# EAGLE schematic memory (EAGLE 6.6.0), part 1 of 2

## Sheet 1 of 15
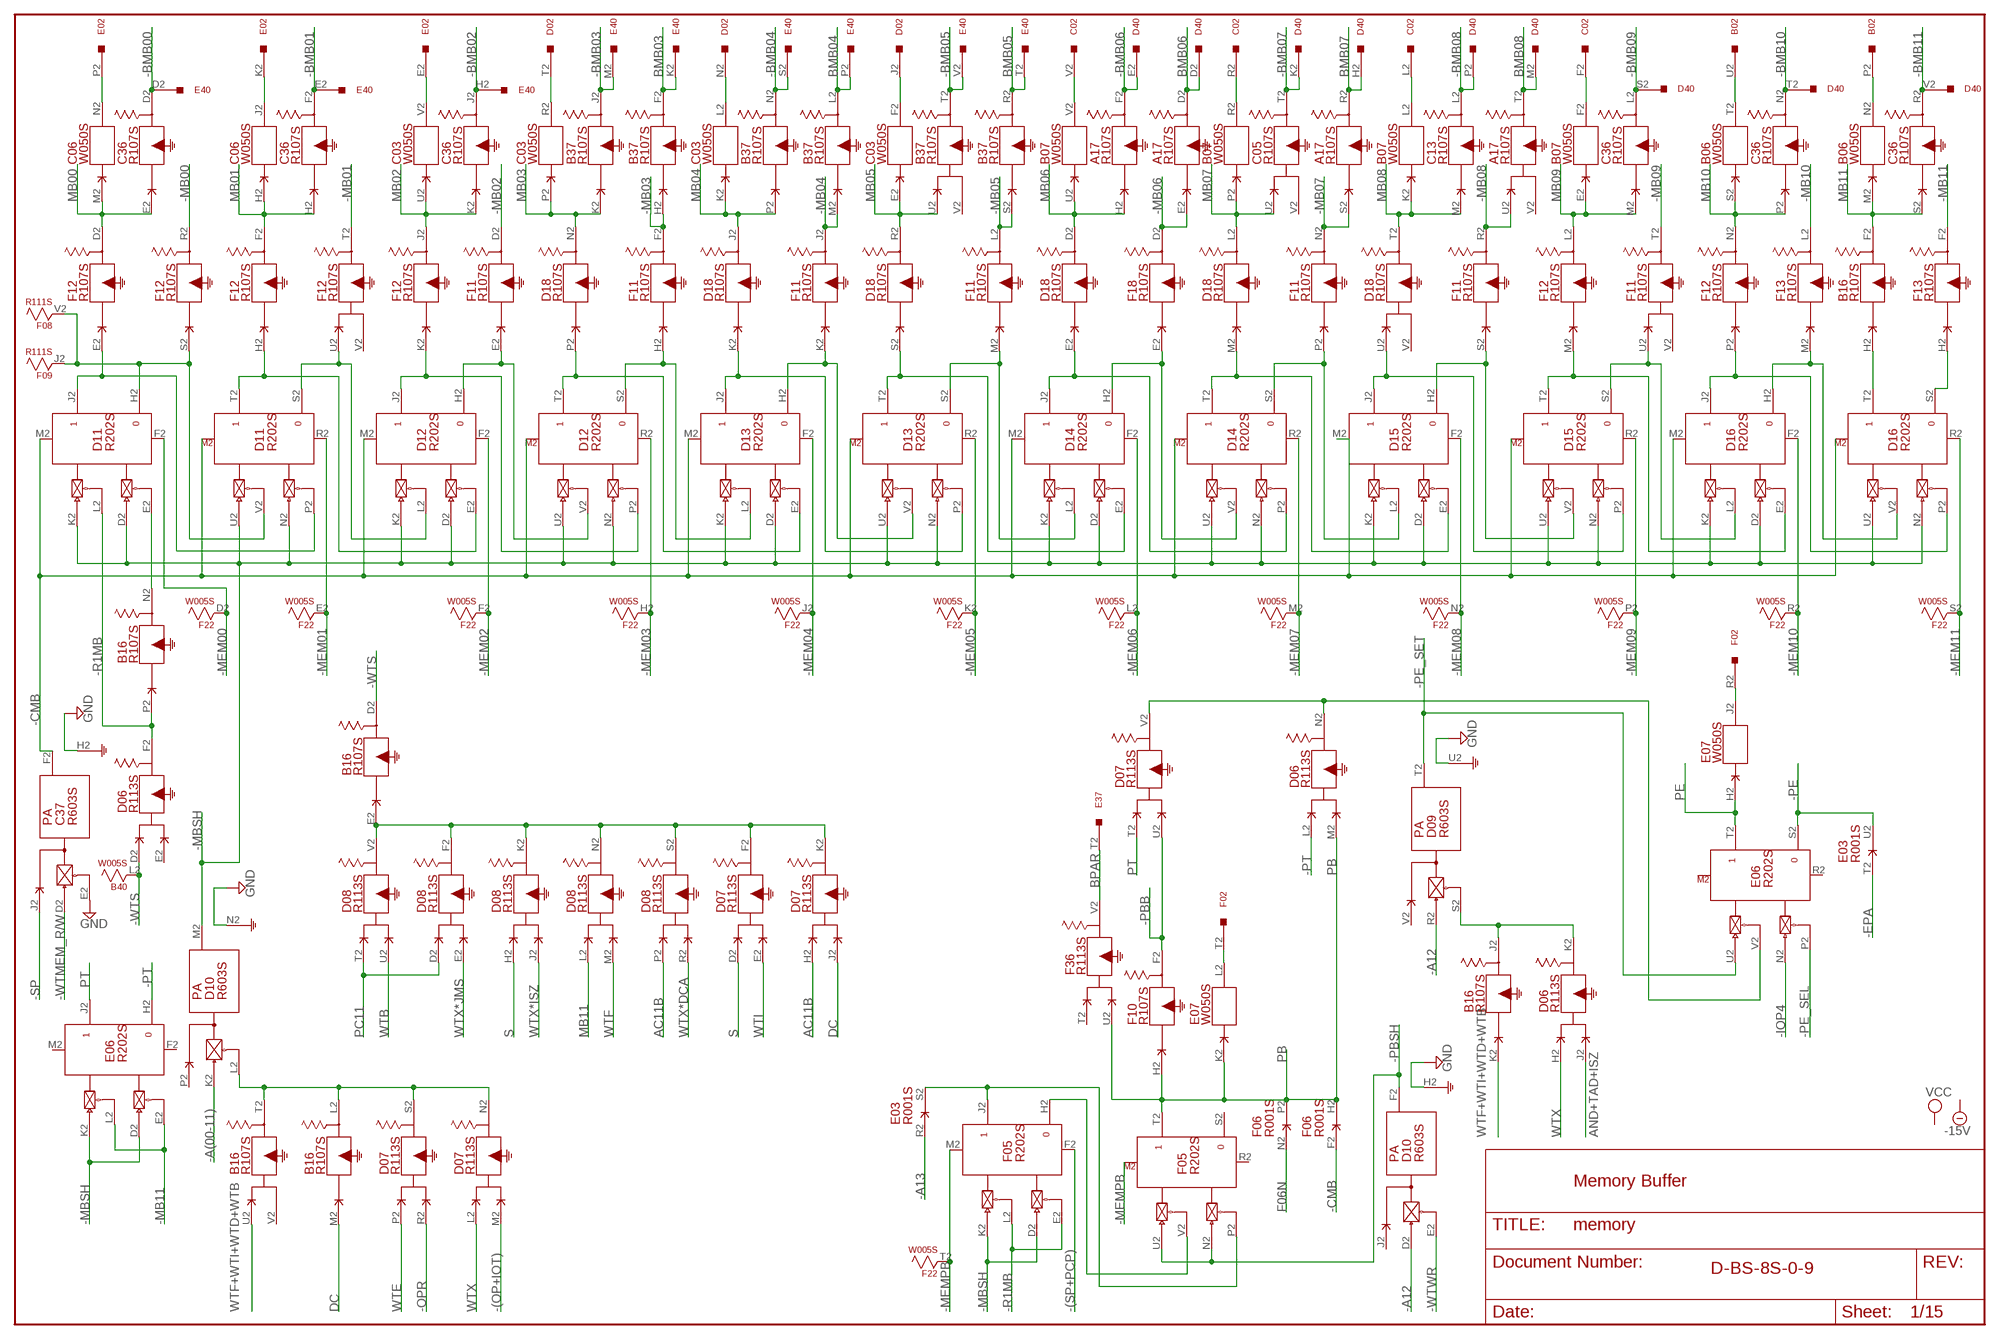
[diagram p0: schematic, sheet 1]

### Parts
A17  R107S  [H807S]
B02  W023S  [H807S]
B06  W050S  [H807S]
B07  W050S  [H807S]
B16  R107S  [H807S]
B37  R107S  [H807S]
B40  W005S  [H807S]
C02  W023S  [H807S]
C03  W050S  [H807S]
C05  R107S  [H807S]
C06  W050S  [H807S]
C13  R107S  [H807S]
C36  R107S  [H807S]
C37  R603S  [H807S]
D02  W023S  [H807S]
D06  R113S  [H807S]
D07  R113S  [H807S]
D08  R113S  [H807S]
D09  R603S  [H807S]
D10  R603S  [H807S]
D11  R202S  [H807S]
D12  R202S  [H807S]
D13  R202S  [H807S]
D14  R202S  [H807S]
D15  R202S  [H807S]
D16  R202S  [H807S]
D18  R107S  [H807S]
D40  W028S  [H807S]
E02  W023S  [H807S]
E03  R001S  [H807S]
E06  R202S  [H807S]
E07  W050S  [H807S]
E37  W028S  [H807S]
E40  W028S  [H807S]
F02  W023S  [H807S]
F05  R202S  [H807S]
F06  R001S  [H807S]
F08  R111S  [H807S]
F09  R111S  [H807S]
F10  R107S  [H807S]
F11  R107S  [H807S]
F12  R107S  [H807S]
F13  R107S  [H807S]
F18  R107S  [H807S]
F22  W005S  [H807S]
F36  R113S  [H807S]

### Nets
-(OP+IOT): D07.M2(N:I$2) ; also sheet 6,9
-(SP+PCP): F05.F2(J:RESET) ; also sheet 3,7,8,10,12,14,15
-A12: D09.R2(T:PU0) D10.D2(F:PU0) ; also sheet 3,4,6,8,10,12,15
-A13: E03.R2(S:D) ; also sheet 4,5,6,7,10,15
-A(00-11): D10.K2(M:PU0) ; also sheet 3,4,5,7,9,11,12
-BMB00: C36.D2(D:O$1) E40.D2
-BMB01: C36.F2(F:O$1) E40.E2
-BMB02: C36.J2(J:O$1) E40.H2
-BMB03: B37.J2(J:O$1) E40.M2
-BMB04: B37.N2(N:O$1) E40.S2
-BMB05: B37.T2(T:O$1) E40.V2
-BMB06: A17.F2(F:O$1) D40.E2
-BMB07: C05.T2(T:O$1) D40.K2
-BMB08: C13.L2(L:O$1) D40.P2
-BMB09: C36.L2(L:O$1) D40.S2
-BMB10: C36.N2(N:O$1) D40.T2
-BMB11: C36.R2(R:O$1) D40.V2
-CMB: C37.F2(F:O) D11.M2(J:SET) D12.M2(J:SET) D13.M2(J:SET) D14.M2(J:SET) D15.M2(J:SET) D16.M2(J:SET) F06.F2(H:D)
-EPA: E03.T2(U:D) ; also sheet 8
-IOP4: E06.N2(T:PU0) ; also sheet 10
-MB00: F12.R2(R:O$1) ; also sheet 2
-MB01: F12.T2(T:O$1) ; also sheet 2
-MB02: F11.D2(D:O$1) ; also sheet 2
-MB03: B37.H2(F:I$1) F11.F2(F:O$1) ; also sheet 2,10
-MB04: B37.M2(L:I$1) F11.J2(J:O$1) ; also sheet 2,5,10
-MB05: B37.S2(R:I$1) F11.L2(L:O$1) ; also sheet 2,6,10
-MB06: A17.E2(D:I$1) F18.D2(D:O$1) ; also sheet 2,6,7,10
-MB07: A17.S2(R:I$1) F11.N2(N:O$1) ; also sheet 2,6,10
-MB08: A17.U2(T:I$1) F11.R2(R:O$1) ; also sheet 2,3,10
-MB09: F11.T2(T:O$1) ; also sheet 2,10
-MB10: F13.L2(L:O$1) ; also sheet 2,9,10
-MB11: E06.E2(J:EN0) E06.L2(J:EN1) F13.F2(F:O$1) ; also sheet 2,9,10
-MBSH: D10.M2(M:O) D11.D2(J:PU0) D11.K2(J:PU1) D11.N2(T:PU0) D11.U2(T:PU1) D12.D2(J:PU0) D12.K2(J:PU1) D12.N2(T:PU0) D12.U2(T:PU1) D13.D2(J:PU0) D13.K2(J:PU1) D13.N2(T:PU0) D13.U2(T:PU1) D14.D2(J:PU0) D14.K2(J:PU1) D14.N2(T:PU0) D14.U2(T:PU1) D15.D2(J:PU0) D15.K2(J:PU1) D15.N2(T:PU0) D15.U2(T:PU1) D16.D2(J:PU0) D16.K2(J:PU1) D16.N2(T:PU0) D16.U2(T:PU1) E06.D2(J:PU0) E06.K2(J:PU1) F05.D2(J:PU0) F05.K2(J:PU1)
-MEM00: D11.F2(J:RESET) F22.D2 ; also sheet 2,15
-MEM01: D11.R2(T:RESET) F22.E2 ; also sheet 2,15
-MEM02: D12.F2(J:RESET) F22.F2 ; also sheet 2,15
-MEM03: D12.R2(T:RESET) F22.H2 ; also sheet 2,15
-MEM04: D13.F2(J:RESET) F22.J2 ; also sheet 2,15
-MEM05: D13.R2(T:RESET) F22.K2 ; also sheet 2,15
-MEM06: D14.F2(J:RESET) F22.L2 ; also sheet 2,15
-MEM07: D14.R2(T:RESET) F22.M2 ; also sheet 2,15
-MEM08: D15.F2(J:RESET) F22.N2 ; also sheet 2,15
-MEM09: D15.R2(T:RESET) F22.P2 ; also sheet 2,15
-MEM10: D16.F2(J:RESET) F22.R2 ; also sheet 2,15
-MEM11: D16.R2(T:RESET) F22.S2 ; also sheet 2,15
-MEMPB: F05.M2(J:SET) F22.T2 ; also sheet 2
-OPR: D07.R2(S:I$2) ; also sheet 9
-PBB: D07.U2(V:I$2) F10.F2(F:O$1) ; also sheet 2
-PBSH: D10.F2(F:O) F05.N2(T:PU0) F05.U2(T:PU1)
-PE: E03.U2(U:E) E06.S2 ; also sheet 10
-PE_SEL: E06.P2(T:EN0) ; also sheet 10
-PE_SET: D09.T2(T:O) E06.U2(T:PU1)
-PT: D06.L2(N:I$1) E06.H2
-R1MB: B16.P2(N:I$1) D06.F2(F:O$1) D11.L2(J:EN1) F05.E2(J:EN0) F05.L2(J:EN1)
-SP: C37.J2(F:I$1) ; also sheet 6,8
-WTMEM_R/W: C37.D2(F:PU0) ; also sheet 6,13
-WTS: B16.D2(D:O$1) B40.L2 D06.D2(F:I$1) ; also sheet 4,6
-WTWR: D10.E2(F:EN0) ; also sheet 6
AC11B: D07.H2(K:I$1) D08.P2(S:I$1) ; also sheet 7,12
AND+TAD+ISZ: D06.J2(K:I$2) ; also sheet 6,9
BMB03: B37.F2(F:O$1) E40.K2
BMB04: B37.L2(L:O$1) E40.P2
BMB05: B37.R2(R:O$1) E40.T2
BMB06: A17.D2(D:O$1) D40.D2
BMB07: A17.R2(R:O$1) D40.H2
BMB08: A17.T2(T:O$1) D40.M2
BPAR: E37.T2 F36.V2(V:O$1)
DC: B16.M2(L:I$1) D07.J2(K:I$2) ; also sheet 8,12
F06N: F06.N2(P:D)
GND [Supply]: C37.E2(F:EN0) C37.H2(F:G) D09.U2(T:G) D10.H2(F:G) D10.N2(M:G) ; also sheet 2,3,4,5,6,7,8,9,10,11,12,14,15
MB00: C06.M2(N:I$1) C36.E2(D:I$1) F12.D2(D:O$1)
MB01: C06.H2(J:I$1) C36.H2(F:I$1) F12.F2(F:O$1)
MB02: C03.U2(V:I$1) C36.K2(J:I$1) F12.J2(J:O$1)
MB03: B37.K2(J:I$1) C03.P2(R:I$1) D18.N2(N:O$1)
MB04: B37.P2(N:I$1) C03.K2(L:I$1) D18.J2(J:O$1) ; also sheet 12
MB05: B37.U2(T:I$1) C03.E2(F:I$1) D18.R2(R:O$1) ; also sheet 3,9,10
MB06: A17.H2(F:I$1) B07.U2(V:I$1) D18.D2(D:O$1) ; also sheet 3,7,9
MB07: B07.P2(R:I$1) C05.U2(T:I$1) D18.L2(L:O$1) ; also sheet 3,9
MB08: B07.K2(L:I$1) C13.M2(L:I$1) D18.T2(T:O$1) ; also sheet 3,6,9
MB09: B07.E2(F:I$1) C36.M2(L:I$1) F12.L2(L:O$1) ; also sheet 3,9
MB10: B06.S2(T:I$1) C36.P2(N:I$1) F12.N2(N:O$1) ; also sheet 8,9
MB11: B06.M2(N:I$1) B16.F2(F:O$1) C36.S2(R:I$1) D08.L2(N:I$1) ; also sheet 5,6,7,9,12
N$1: D11.J2 D11.P2(T:EN0) F12.E2(D:I$1)
N$2: C06.N2(N:O$1) E02.P2
N$3: D11.H2 D11.V2(T:EN1) F08.V2 F09.J2 F12.S2(R:I$1)
N$4: D11.T2 D12.E2(J:EN0) F12.H2(F:I$1)
N$5: B16.E2(D:I$1) D07.F2(F:O$1) D07.K2(K:O$1) D08.F2(F:O$1) D08.K2(K:O$1) D08.N2(N:O$1) D08.S2(S:O$1) D08.V2(V:O$1)
N$6: D12.J2 D12.P2(T:EN0) F12.K2(J:I$1)
N$7: D12.T2 D13.E2(J:EN0) D18.P2(N:I$1)
N$8: D13.J2 D13.P2(T:EN0) D18.K2(J:I$1)
N$9: D13.T2 D14.E2(J:EN0) D18.S2(R:I$1)
N$10: D14.J2 D14.P2(T:EN0) D18.E2(D:I$1)
N$11: D14.T2 D15.E2(J:EN0) D18.M2(L:I$1)
N$12: D15.J2 D15.P2(T:EN0) D18.U2(T:I$1)
N$13: D15.H2 D15.V2(T:EN1) F11.S2(R:I$1)
N$14: D14.S2 D15.L2(J:EN1) F11.P2(N:I$1)
N$15: D14.H2 D14.V2(T:EN1) F18.E2(D:I$1)
N$16: D13.S2 D14.L2(J:EN1) F11.M2(L:I$1)
N$17: D15.T2 D16.E2(J:EN0) F12.M2(L:I$1)
N$18: D15.S2 D16.L2(J:EN1) F11.U2(T:I$1)
N$19: D16.J2 D16.P2(T:EN0) F12.P2(N:I$1)
N$20: D13.H2 D13.V2(T:EN1) F11.K2(J:I$1)
N$21: D12.S2 D13.L2(J:EN1) F11.H2(F:I$1)
N$22: D12.H2 D12.V2(T:EN1) F11.E2(D:I$1)
N$23: D11.S2 D12.L2(J:EN1) F12.U2(T:I$1)
N$24: D16.H2 D16.V2(T:EN1) F13.M2(L:I$1)
N$25: B16.H2(F:I$1) D16.T2
N$26: D16.S2 F13.H2(F:I$1)
N$27: C06.J2(J:O$1) E02.K2
N$28: C03.V2(V:O$1) E02.E2
N$29: C03.R2(R:O$1) D02.T2
N$30: C03.L2(L:O$1) D02.N2
N$31: C03.F2(F:O$1) D02.J2
N$32: B07.V2(V:O$1) C02.V2
N$33: B07.R2(R:O$1) C02.R2
N$34: B07.L2(L:O$1) C02.L2
N$35: B07.F2(F:O$1) C02.F2
N$36: B02.U2 B06.T2(T:O$1)
N$37: B02.P2 B06.N2(N:O$1)
N$38: B16.L2(L:O$1) B16.T2(T:O$1) D07.N2(N:O$1) D07.S2(S:O$1) D10.L2(M:EN0)
N$39: B16.N2(N:O$1) D11.E2(J:EN0)
N$40: B16.J2(J:O$1) D06.K2(K:O$1) D09.S2(T:EN0)
N$41: E07.J2(J:O$1) F02.R2
N$42: D06.N2(N:O$1) D07.V2(V:O$1) E06.V2(T:EN1)
N$44: E07.L2(L:O$1) F02.T2
N$46: F05.H2 F05.V2(T:EN1)
N$47: E03.S2(S:E) F05.J2 F05.P2(T:EN0)
PB: D06.M2(N:I$2) E07.K2(L:I$1) F05.T2 F06.H2(H:E) F06.P2(P:E) F10.H2(F:I$1) F36.U2(V:I$2)
PC11: D08.D2(F:I$1) D08.T2(V:I$1) ; also sheet 5,7,11
PE: E06.T2 E07.H2(J:I$1) ; also sheet 10
PT: D07.T2(V:I$1) E06.J2
S: D07.D2(F:I$1) D08.H2(K:I$1) ; also sheet 5,7,11,12
WTB: D08.U2(V:I$2) ; also sheet 6
WTE: D07.P2(S:I$1) ; also sheet 3,6,8
WTF: D08.M2(N:I$2) ; also sheet 3,5,6,8,10,12
WTF+WTI+WTD+WTB: B16.K2(J:I$1) B16.U2(T:I$1) ; also sheet 6
WTI: D07.E2(F:I$2) ; also sheet 6
WTX: D06.H2(K:I$1) D07.L2(N:I$1) ; also sheet 3,6,7,10,12,15
WTX*DCA: D08.R2(S:I$2) ; also sheet 6
WTX*ISZ: D08.J2(K:I$2) ; also sheet 6
WTX*JMS: D08.E2(F:I$2) ; also sheet 6
Unconnected: A17.V2(T:I$2) B02.A2 B02.B2 B02.C2 B02.S2 B16.V2(T:I$2) B37.V2(T:I$2) B40.R2 C02.A2 C02.B2 C02.C2 C02.D2 C02.J2 C02.N2 C02.T2 C05.V2(T:I$2) C36.T2(T:O$1) C36.U2(T:I$1) C36.V2(T:I$2) D02.A2 D02.B2 D02.C2 D02.D2 D02.H2 D02.M2 D02.S2 D02.V2 D06.E2(F:I$2) D09.V2(T:I$1) D10.J2(F:I$1) D10.P2(M:I$1) D18.V2(T:I$2) E02.A2 E02.B2 E02.C2 E02.J2 E02.N2 E06.F2(J:RESET) E06.M2(J:SET) E06.R2(T:RESET) E07.P2(R:I$1) E07.R2(R:O$1) E07.S2(T:I$1) E07.T2(T:O$1) F02.A2 F02.B2 F02.C2 F02.N2 F02.P2 F02.S2 F02.U2 F05.R2(T:RESET) F05.S2 F11.V2(T:I$2) F12.V2(T:I$2) F22.V2 F36.T2(V:I$1)

### Notes on the sheet
- Memory Buffer
- D-BS-8S-0-9

## Sheet 2 of 15
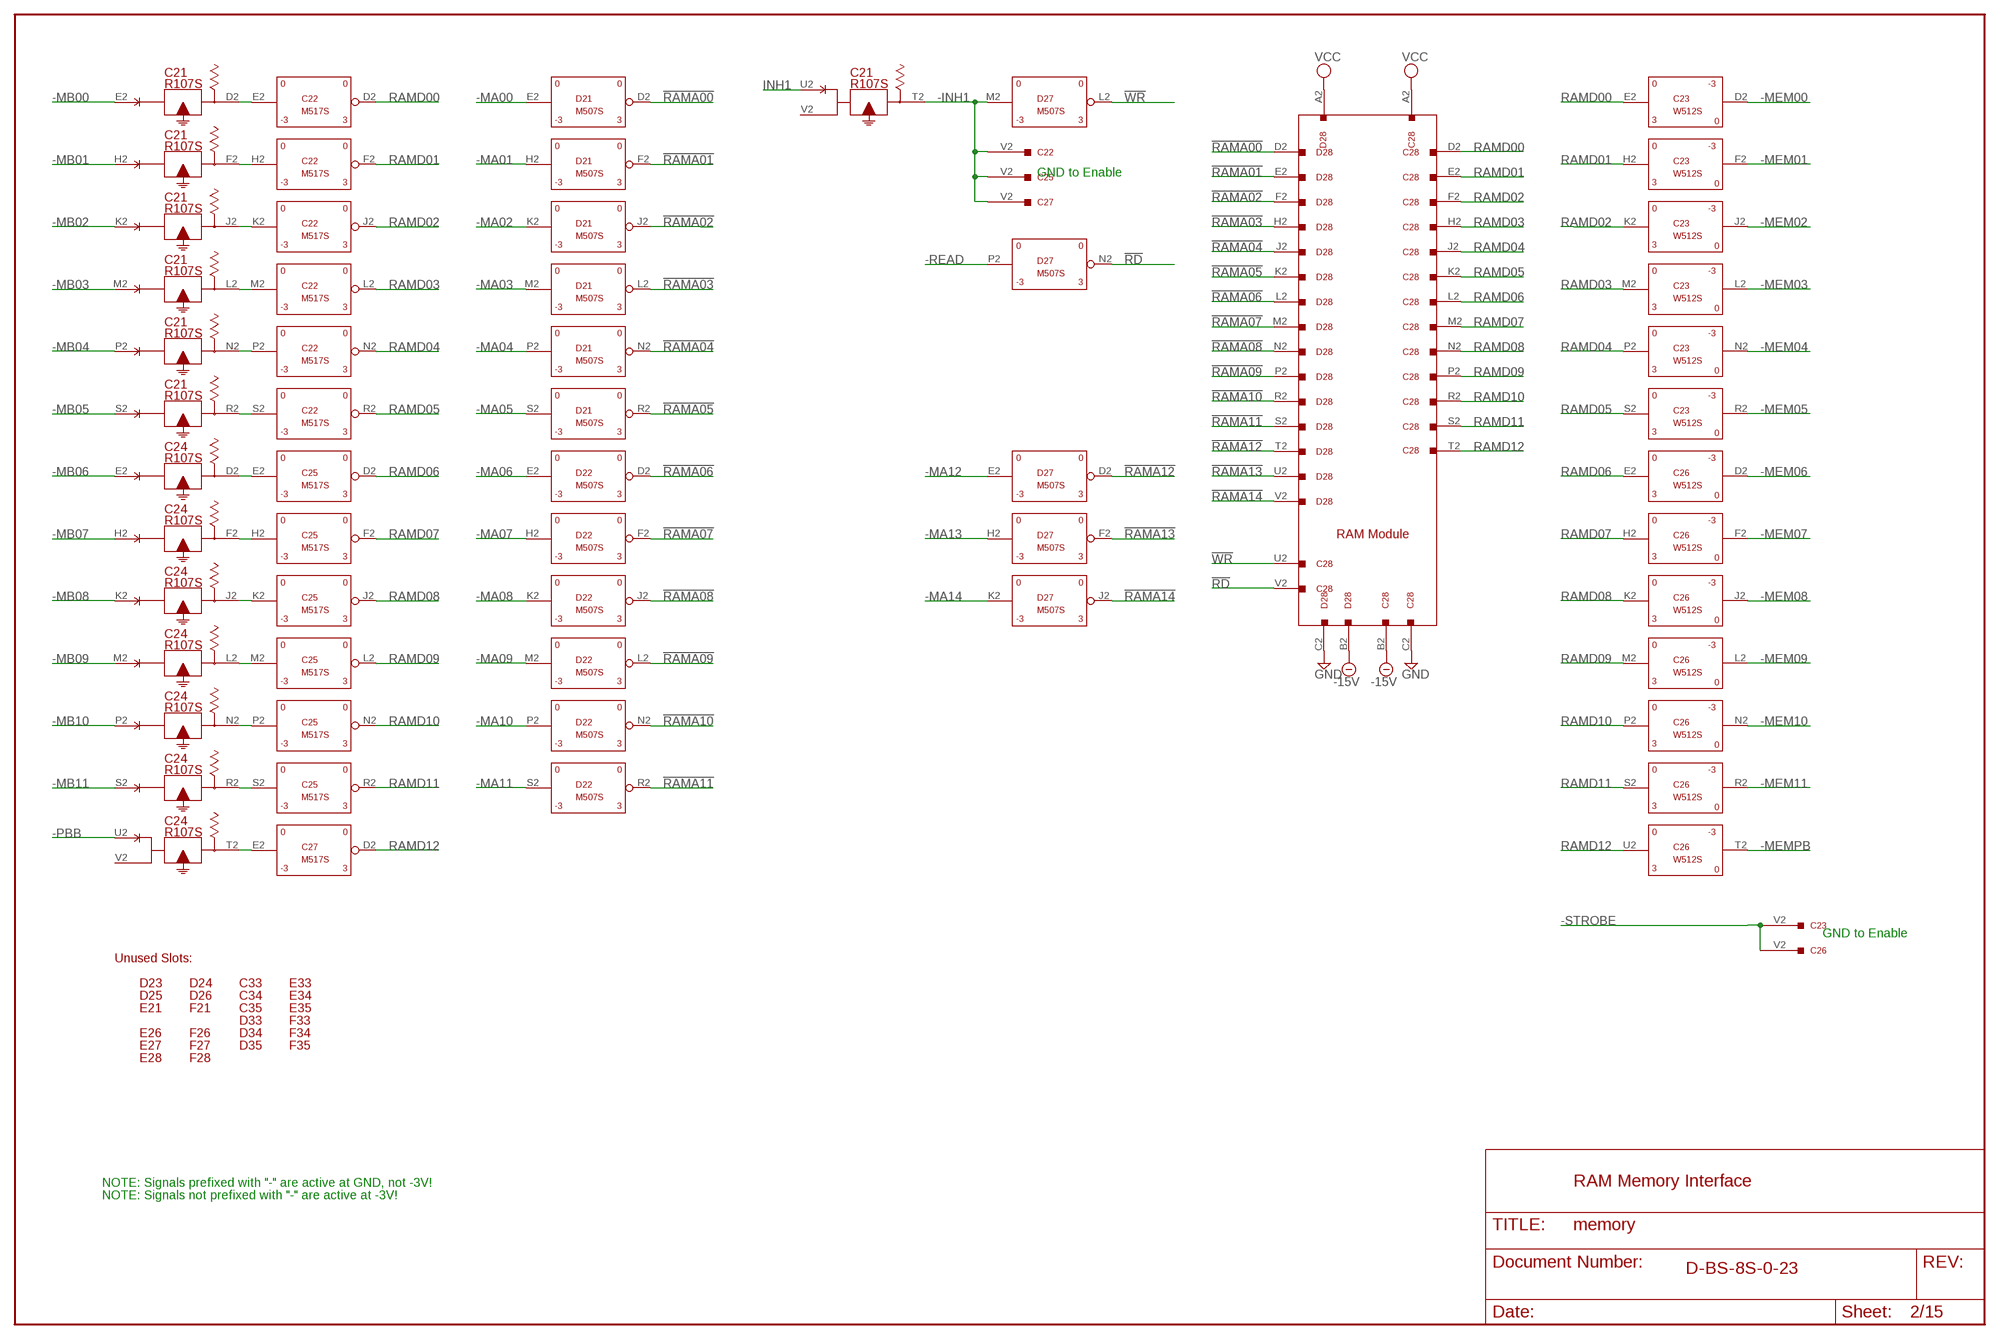
[diagram p1: schematic, sheet 2]

### Parts
C21  R107S  [H807S]
C22  M517S  [H807S]
C23  W512S  [H807S]
C24  R107S  [H807S]
C25  M517S  [H807S]
C26  W512S  [H807S]
C27  M517S  [H807S]
C28  W023S  [H807S]
C33  EMPTYS  [H807S]
C34  EMPTYS  [H807S]
C35  EMPTYS  [H807S]
D21  M507S  [H807S]
D22  M507S  [H807S]
D23  EMPTYS  [H807S]
D24  EMPTYS  [H807S]
D25  EMPTYS  [H807S]
D26  EMPTYS  [H807S]
D27  M507S  [H807S]
D28  W023S  [H807S]
D33  EMPTYS  [H807S]
D34  EMPTYS  [H807S]
D35  EMPTYS  [H807S]
E21  EMPTYS  [H807S]
E26  EMPTYS  [H807S]
E27  EMPTYS  [H807S]
E28  EMPTYS  [H807S]
E33  EMPTYS  [H807S]
E34  EMPTYS  [H807S]
E35  EMPTYS  [H807S]
F21  EMPTYS  [H807S]
F26  EMPTYS  [H807S]
F27  EMPTYS  [H807S]
F28  EMPTYS  [H807S]
F33  EMPTYS  [H807S]
F34  EMPTYS  [H807S]
F35  EMPTYS  [H807S]

### Nets
!RAMA00: D21.D2(D:OUT) D28.D2
!RAMA01: D21.F2(F:OUT) D28.E2
!RAMA02: D21.J2(J:OUT) D28.F2
!RAMA03: D21.L2(L:OUT) D28.H2
!RAMA04: D21.N2(N:OUT) D28.J2
!RAMA05: D21.R2(R:OUT) D28.K2
!RAMA06: D22.D2(D:OUT) D28.L2
!RAMA07: D22.F2(F:OUT) D28.M2
!RAMA08: D22.J2(J:OUT) D28.N2
!RAMA09: D22.L2(L:OUT) D28.P2
!RAMA10: D22.N2(N:OUT) D28.R2
!RAMA11: D22.R2(R:OUT) D28.S2
!RAMA12: D27.D2(D:OUT) D28.T2
!RAMA13: D27.F2(F:OUT) D28.U2
!RAMA14: D27.J2(J:OUT) D28.V2
!RD: C28.V2 D27.N2(N:OUT)
!WR: C28.U2 D27.L2(L:OUT)
-15V [Supply]: C28.B2 D28.B2
-INH1: C21.T2(T:O$1) C22.V2 C25.V2 C27.V2 D27.M2(L:IN)
-MA00: D21.E2(D:IN) ; also sheet 5,15
-MA01: D21.H2(F:IN) ; also sheet 5,15
-MA02: D21.K2(J:IN) ; also sheet 5,15
-MA03: D21.M2(L:IN) ; also sheet 5,15
-MA04: D21.P2(N:IN) ; also sheet 5,6,15
-MA05: D21.S2(R:IN) ; also sheet 5,15
-MA06: D22.E2(D:IN) ; also sheet 5,15
-MA07: D22.H2(F:IN) ; also sheet 5,15
-MA08: D22.K2(J:IN) ; also sheet 5,15
-MA09: D22.M2(L:IN) ; also sheet 5,15
-MA10: D22.P2(N:IN) ; also sheet 5,15
-MA11: D22.S2(R:IN) ; also sheet 5,15
-MA12: D27.E2(D:IN)
-MA13: D27.H2(F:IN)
-MA14: D27.K2(J:IN)
-MB00: C21.E2(D:I$1) ; also sheet 1
-MB01: C21.H2(F:I$1) ; also sheet 1
-MB02: C21.K2(J:I$1) ; also sheet 1
-MB03: C21.M2(L:I$1) ; also sheet 1,10
-MB04: C21.P2(N:I$1) ; also sheet 1,5,10
-MB05: C21.S2(R:I$1) ; also sheet 1,6,10
-MB06: C24.E2(D:I$1) ; also sheet 1,6,7,10
-MB07: C24.H2(F:I$1) ; also sheet 1,6,10
-MB08: C24.K2(J:I$1) ; also sheet 1,3,10
-MB09: C24.M2(L:I$1) ; also sheet 1,10
-MB10: C24.P2(N:I$1) ; also sheet 1,9,10
-MB11: C24.S2(R:I$1) ; also sheet 1,9,10
-MEM00: C23.D2(OUT) ; also sheet 1,15
-MEM01: C23.F2(OUT) ; also sheet 1,15
-MEM02: C23.J2(OUT) ; also sheet 1,15
-MEM03: C23.L2(OUT) ; also sheet 1,15
-MEM04: C23.N2(OUT) ; also sheet 1,15
-MEM05: C23.R2(OUT) ; also sheet 1,15
-MEM06: C26.D2(OUT) ; also sheet 1,15
-MEM07: C26.F2(OUT) ; also sheet 1,15
-MEM08: C26.J2(OUT) ; also sheet 1,15
-MEM09: C26.L2(OUT) ; also sheet 1,15
-MEM10: C26.N2(OUT) ; also sheet 1,15
-MEM11: C26.R2(OUT) ; also sheet 1,15
-MEMPB: C26.T2(OUT) ; also sheet 1
-PBB: C24.U2(T:I$1) ; also sheet 1
-READ: D27.P2(N:IN) ; also sheet 13
-STROBE: C23.V2 C26.V2 ; also sheet 13
GND [Supply]: C28.C2 D28.C2 ; also sheet 1,3,4,5,6,7,8,9,10,11,12,14,15
INH1: C21.U2(T:I$1) ; also sheet 13
N$49: C24.D2(D:O$1) C25.E2(D:IN)
N$50: C21.R2(R:O$1) C22.S2(R:IN)
N$51: C21.N2(N:O$1) C22.P2(N:IN)
N$52: C21.L2(L:O$1) C22.M2(L:IN)
N$55: C21.J2(J:O$1) C22.K2(J:IN)
N$56: C21.F2(F:O$1) C22.H2(F:IN)
N$57: C21.D2(D:O$1) C22.E2(D:IN)
N$58: C24.F2(F:O$1) C25.H2(F:IN)
N$59: C24.J2(J:O$1) C25.K2(J:IN)
N$60: C24.L2(L:O$1) C25.M2(L:IN)
N$61: C24.N2(N:O$1) C25.P2(N:IN)
N$62: C24.R2(R:O$1) C25.S2(R:IN)
N$63: C24.T2(T:O$1) C27.E2(D:IN)
RAMD00: C22.D2(D:OUT) C23.E2(IN) C28.D2
RAMD01: C22.F2(F:OUT) C23.H2(IN) C28.E2
RAMD02: C22.J2(J:OUT) C23.K2(IN) C28.F2
RAMD03: C22.L2(L:OUT) C23.M2(IN) C28.H2
RAMD04: C22.N2(N:OUT) C23.P2(IN) C28.J2
RAMD05: C22.R2(R:OUT) C23.S2(IN) C28.K2
RAMD06: C25.D2(D:OUT) C26.E2(IN) C28.L2
RAMD07: C25.F2(F:OUT) C26.H2(IN) C28.M2
RAMD08: C25.J2(J:OUT) C26.K2(IN) C28.N2
RAMD09: C25.L2(L:OUT) C26.M2(IN) C28.P2
RAMD10: C25.N2(N:OUT) C26.P2(IN) C28.R2
RAMD11: C25.R2(R:OUT) C26.S2(IN) C28.S2
RAMD12: C26.U2(IN) C27.D2(D:OUT) C28.T2
VCC [Supply]: C28.A2 D28.A2
Unconnected: C21.V2(T:I$2) C23.T2(OUT) C23.U2(IN) C24.V2(T:I$2) C27.F2(F:OUT) C27.H2(F:IN) C27.J2(J:OUT) C27.K2(J:IN) C27.L2(L:OUT) C27.M2(L:IN) C27.N2(N:OUT) C27.P2(N:IN) C27.R2(R:OUT) C27.S2(R:IN) D27.R2(R:OUT) D27.S2(R:IN)

### Notes on the sheet
- GND to Enable
- RAM Module
- GND to Enable
- Unused Slots:
- NOTE: Signals prefixed with "-" are active at GND, not -3V! | RAM Memory Interface
- NOTE: Signals not prefixed with "-" are active at -3V!
- D-BS-8S-0-23

## Sheet 3 of 15
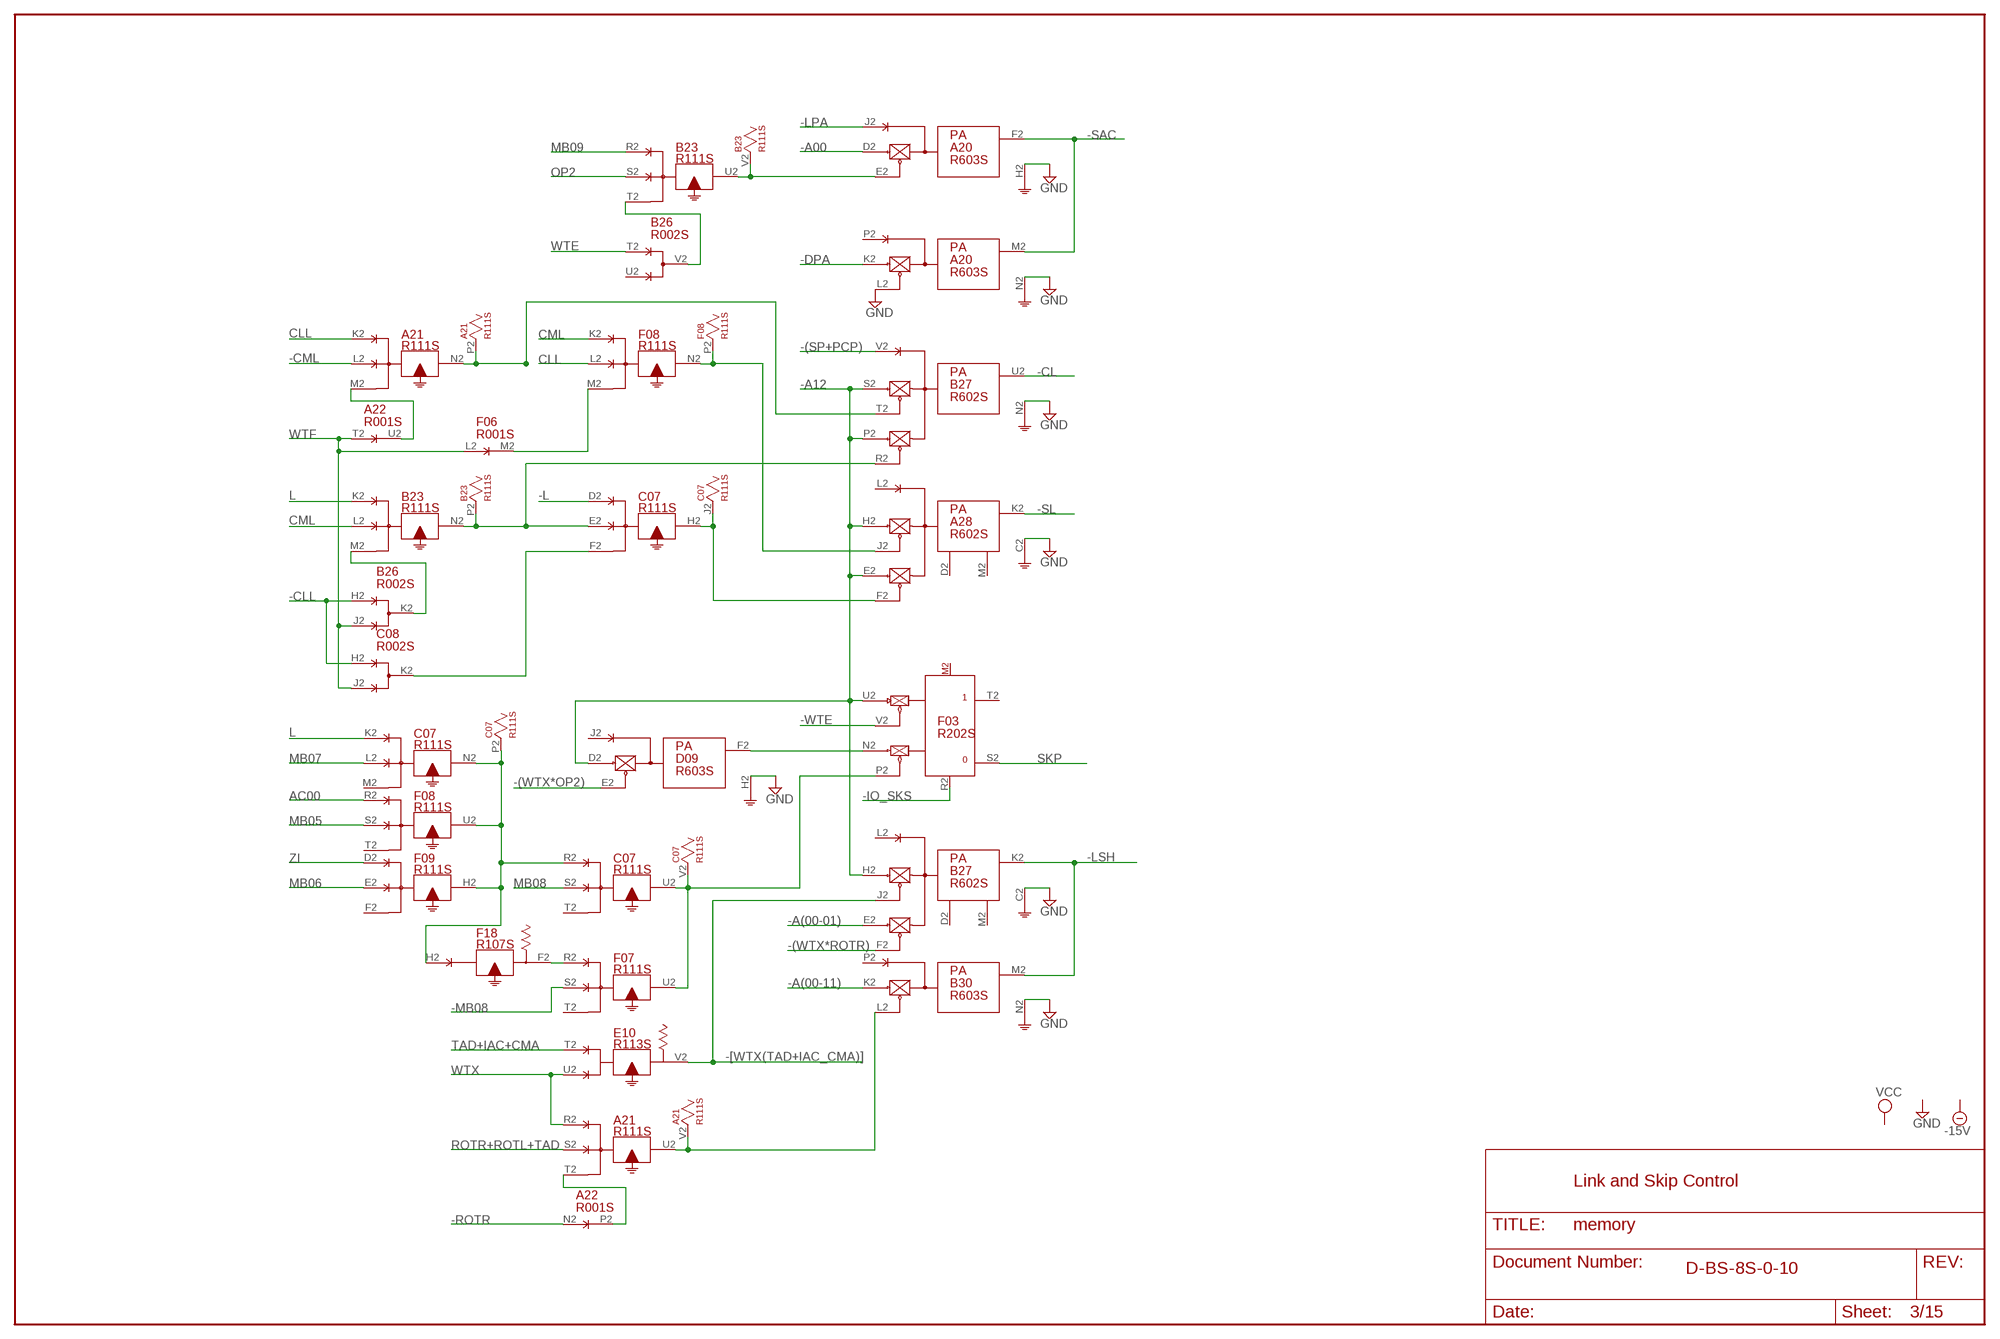
[diagram p2: schematic, sheet 3]

### Parts
A20  R603S  [H807S]
A21  R111S  [H807S]
A22  R001S  [H807S]
A28  R602S  [H807S]
B23  R111S  [H807S]
B26  R002S  [H807S]
B27  R602S  [H807S]
B30  R603S  [H807S]
C07  R111S  [H807S]
C08  R002S  [H807S]
E10  R113S  [H807S]
F03  R202S  [H807S]
F07  R111S  [H807S]

### Nets
-(SP+PCP): B27.V2(U:L) ; also sheet 1,7,8,10,12,14,15
-(WTX*OP2): D09.E2(F:EN0) ; also sheet 6,7
-(WTX*ROTR): B27.F2(K:F) ; also sheet 6,12
-[WTX(TAD+IAC_CMA)]: B27.J2(K:J) E10.V2(V:O$1)
-A00: A20.D2(F:PU0) ; also sheet 4,5,9,10,14,15
-A12: A28.E2(K:E) A28.H2(K:H) B27.H2(K:H) B27.P2(U:E) B27.S2(U:H) D09.D2(F:PU0) F03.U2(T:PU1) ; also sheet 1,4,6,8,10,12,15
-A(00-01): B27.E2(K:E) ; also sheet 4,12
-A(00-11): B30.K2(M:PU0) ; also sheet 1,4,5,7,9,11,12
-CL: B27.U2(U:K) ; also sheet 12
-CLL: B26.H2(K:D) C08.H2(K:D) ; also sheet 9
-CML: A21.L2(N:I$2) ; also sheet 9
-DPA: A20.K2(M:PU0) ; also sheet 8
-IO_SKS: F03.R2(T:RESET) ; also sheet 10
-L: C07.D2(H:I$1) ; also sheet 12
-LPA: A20.J2(F:I$1) ; also sheet 8
-LSH: B27.K2(K:K) B30.M2(M:O) ; also sheet 12
-MB08: F07.S2(U:I$2) ; also sheet 1,2,10
-ROTR: A22.N2(P:D) ; also sheet 9
-SAC: A20.F2(F:O) A20.M2(M:O) ; also sheet 8
-SL: A28.K2(K:K) ; also sheet 12
-WTE: F03.V2(T:EN1) ; also sheet 6
AC00: F08.R2(U:I$1) ; also sheet 12
CLL: A21.K2(N:I$1) F08.L2(N:I$2) ; also sheet 9
CML: B23.L2(N:I$2) F08.K2(N:I$1) ; also sheet 9
GND [Supply]: A20.H2(F:G) A20.L2(M:EN0) A20.N2(M:G) A28.C2(K:GND) B27.C2(K:GND) B27.N2(U:C) B30.N2(M:G) D09.H2(F:G) ; also sheet 1,2,4,5,6,7,8,9,10,11,12,14,15
L: B23.K2(N:I$1) C07.K2(N:I$1) ; also sheet 7,12
MB05: F08.S2(U:I$2) ; also sheet 1,9,10
MB06: F09.E2(H:I$2) ; also sheet 1,7,9
MB07: C07.L2(N:I$2) ; also sheet 1,9
MB08: C07.S2(U:I$2) ; also sheet 1,6,9
MB09: B23.R2(U:I$1) ; also sheet 1,9
N$48: A20.E2(F:EN0) B23.U2(U:O$1) B23.V2
N$53: B23.T2(U:I$3) B26.V2(V:F)
N$54: A28.J2(K:J) F08.N2(N:O$1) F08.P2
N$64: A21.N2(N:O$1) A21.P2 B27.T2(U:J)
N$65: B23.N2(N:O$1) B23.P2 B27.R2(U:F) C07.E2(H:I$2)
N$66: A28.F2(K:F) C07.H2(H:O$1) C07.J2
N$67: B23.M2(N:I$3) B26.K2(K:F)
N$68: F06.M2(M:E) F08.M2(N:I$3)
N$69: C07.F2(H:I$3) C08.K2(K:F)
N$71: D09.F2(F:O) F03.N2(T:PU0)
N$72: C07.U2(U:O$1) C07.V2 F03.P2(T:EN0) F07.U2(U:O$1)
N$73: F07.R2(U:I$1) F18.F2(F:O$1)
N$74: C07.N2(N:O$1) C07.P2 C07.R2(U:I$1) F08.U2(U:O$1) F09.H2(H:O$1) F18.H2(F:I$1)
N$75: A21.U2(U:O$1) A21.V2 B30.L2(M:EN0)
N$76: A21.T2(U:I$3) A22.P2(P:E)
N$79: A21.M2(N:I$3) A22.U2(U:E)
OP2: B23.S2(U:I$2) ; also sheet 6,7,8,9,12
ROTR+ROTL+TAD: A21.S2(U:I$2) ; also sheet 9,12
SKP: F03.S2 ; also sheet 9
TAD+IAC+CMA: E10.T2(V:I$1) ; also sheet 9,12
WTE: B26.T2(V:D) ; also sheet 1,6,8
WTF: A22.T2(U:D) B26.J2(K:E) C08.J2(K:E) F06.L2(M:D) ; also sheet 1,5,6,8,10,12
WTX: A21.R2(U:I$1) E10.U2(V:I$2) ; also sheet 1,6,7,10,12,15
ZI: F09.D2(H:I$1) ; also sheet 7,9
Unconnected: A20.P2(M:I$1) A28.D2(K:D) A28.L2(K:L) A28.M2(K:M) B26.U2(V:E) B27.D2(K:D) B27.L2(K:L) B27.M2(K:M) B30.P2(M:I$1) C07.M2(N:I$3) C07.T2(U:I$3) C08.L2(N:D) C08.M2(N:E) C08.N2(N:F) D09.J2(F:I$1) F03.T2 F07.P2 F07.T2(U:I$3) F07.V2 F08.T2(U:I$3) F09.F2(H:I$3)

### Notes on the sheet
- Link and Skip Control
- D-BS-8S-0-10

## Sheet 4 of 15
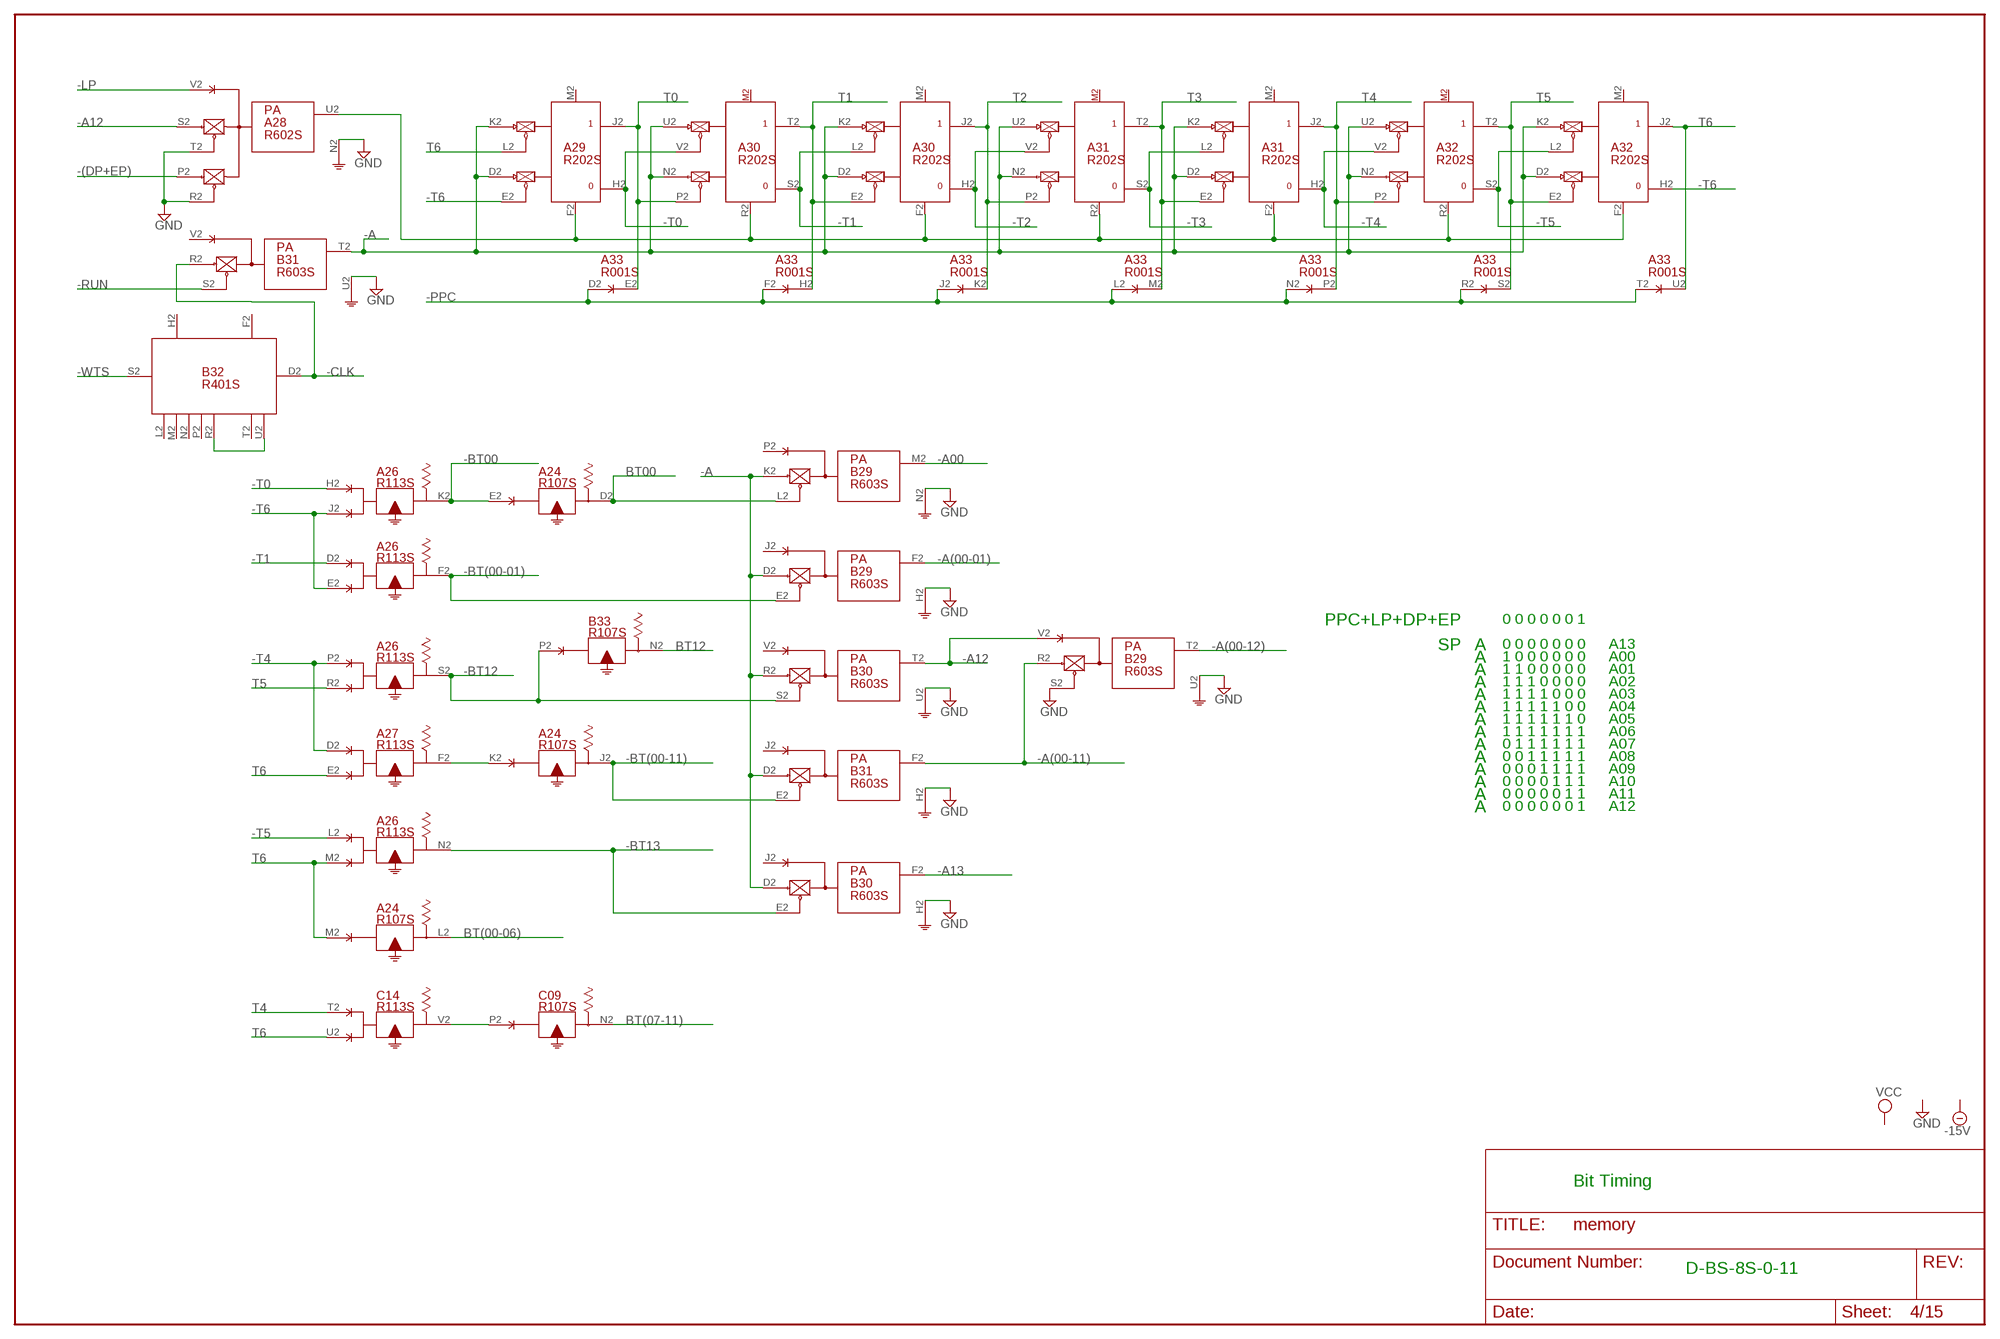
[diagram p3: schematic, sheet 4]

### Parts
A24  R107S  [H807S]
A26  R113S  [H807S]
A27  R113S  [H807S]
A29  R202S  [H807S]
A30  R202S  [H807S]
A31  R202S  [H807S]
A32  R202S  [H807S]
A33  R001S  [H807S]
B29  R603S  [H807S]
B31  R603S  [H807S]
B32  R401S  [H807S]
B33  R107S  [H807S]
C09  R107S  [H807S]
C14  R113S  [H807S]

### Nets
-(DP+EP): A28.P2(U:E) ; also sheet 6,8,12
-A: A29.D2(J:PU0) A29.K2(J:PU1) A30.D2(J:PU0) A30.K2(J:PU1) A30.N2(T:PU0) A30.U2(T:PU1) A31.D2(J:PU0) A31.K2(J:PU1) A31.N2(T:PU0) A31.U2(T:PU1) A32.D2(J:PU0) A32.K2(J:PU1) A32.N2(T:PU0) A32.U2(T:PU1) B29.D2(F:PU0) B29.K2(M:PU0) B30.D2(F:PU0) B30.R2(T:PU0) B31.D2(F:PU0) B31.T2(T:O) ; also sheet 15
-A00: B29.M2(M:O) ; also sheet 3,5,9,10,14,15
-A12: A28.S2(U:H) B29.V2(T:I$1) B30.T2(T:O) ; also sheet 1,3,6,8,10,12,15
-A13: B30.F2(F:O) ; also sheet 1,5,6,7,10,15
-A(00-01): B29.F2(F:O) ; also sheet 3,12
-A(00-11): B29.R2(T:PU0) B31.F2(F:O) ; also sheet 1,3,5,7,9,11,12
-A(00-12): B29.T2(T:O) ; also sheet 7
-BT00: A24.E2(D:I$1) A26.K2(K:O$1)
-BT12: A26.S2(S:O$1) B30.S2(T:EN0) B33.P2(N:I$1) ; also sheet 7
-BT13: A26.N2(N:O$1) B30.E2(F:EN0)
-BT(00-01): A26.F2(F:O$1) B29.E2(F:EN0)
-BT(00-11): A24.J2(J:O$1) B31.E2(F:EN0)
-CLK: B31.R2(T:PU0) B32.D2(D) ; also sheet 8,15
-LP: A28.V2(U:L) ; also sheet 6,8,12,15
-PPC: A33.D2(E:D) A33.F2(H:D) A33.J2(K:D) A33.L2(M:D) A33.N2(P:D) A33.R2(S:D) A33.T2(U:D) ; also sheet 6,8,10,11,15
-RUN: B31.S2(T:EN0) ; also sheet 8,10
-T0: A26.H2(K:I$1) A29.H2 A30.V2(T:EN1)
-T1: A26.D2(F:I$1) A30.L2(J:EN1) A30.S2
-T2: A30.H2 A31.V2(T:EN1)
-T3: A31.L2(J:EN1) A31.S2 ; also sheet 15
-T4: A26.P2(S:I$1) A27.D2(F:I$1) A31.H2 A32.V2(T:EN1)
-T5: A26.L2(N:I$1) A32.L2(J:EN1) A32.S2
-T6: A26.E2(F:I$2) A26.J2(K:I$2) A29.E2(J:EN0) A32.H2
-WTS: B32.S2(S) ; also sheet 1,6
BT00: A24.D2(D:O$1) B29.L2(M:EN0) ; also sheet 7,9,15
BT12: B33.N2(N:O$1) ; also sheet 7
BT(00-06): A24.L2(L:O$1) ; also sheet 6
BT(07-11): C09.N2(N:O$1) ; also sheet 6
GND [Supply]: A28.N2(U:C) A28.R2(U:F) A28.T2(U:J) B29.H2(F:G) B29.N2(M:G) B29.S2(T:EN0) B29.U2(T:G) B30.H2(F:G) B30.U2(T:G) B31.H2(F:G) B31.U2(T:G) ; also sheet 1,2,3,5,6,7,8,9,10,11,12,14,15
N$77: A24.K2(J:I$1) A27.F2(F:O$1)
N$78: C09.P2(N:I$1) C14.V2(V:O$1)
N$88: B32.R2(R) B32.U2(U)
N$94: A28.U2(U:K) A29.F2(J:RESET) A30.F2(J:RESET) A30.R2(T:RESET) A31.F2(J:RESET) A31.R2(T:RESET) A32.F2(J:RESET) A32.R2(T:RESET)
T0: A29.J2 A30.P2(T:EN0) A33.E2(E:E)
T1: A30.E2(J:EN0) A30.T2 A33.H2(H:E)
T2: A30.J2 A31.P2(T:EN0) A33.K2(K:E)
T3: A31.E2(J:EN0) A31.T2 A33.M2(M:E)
T4: A31.J2 A32.P2(T:EN0) A33.P2(P:E) C14.T2(V:I$1) ; also sheet 15
T5: A26.R2(S:I$2) A32.E2(J:EN0) A32.T2 A33.S2(S:E)
T6: A24.M2(L:I$1) A26.M2(N:I$2) A27.E2(F:I$2) A29.L2(J:EN1) A32.J2 A33.U2(U:E) C14.U2(V:I$2)
Unconnected: A29.M2(J:SET) A30.M2(J:SET) A31.M2(J:SET) A32.M2(J:SET) B29.J2(F:I$1) B29.P2(M:I$1) B30.J2(F:I$1) B30.V2(T:I$1) B31.J2(F:I$1) B31.V2(T:I$1) B32.F2(F) B32.H2(H) B32.L2(L) B32.M2(M) B32.N2(N) B32.P2(P) B32.T2(T)

### Notes on the sheet
- PPC+LP+DP+EP | 0 | 0 | 0 | 0 | 0 | 0 | 1
- SP | A | 0 | 0 | 0 | 0 | 0 | 0 | 0 | A13
- A | 1 | 0 | 0 | 0 | 0 | 0 | 0 | A00
- A | 1 | 1 | 0 | 0 | 0 | 0 | 0 | A01
- A | 1 | 1 | 1 | 0 | 0 | 0 | 0 | A02
- A | 1 | 1 | 1 | 1 | 0 | 0 | 0 | A03
- A | 1 | 1 | 1 | 1 | 1 | 0 | 0 | A04
- A | 1 | 1 | 1 | 1 | 1 | 1 | 0 | A05
- A | 1 | 1 | 1 | 1 | 1 | 1 | 1 | A06
- A | 0 | 1 | 1 | 1 | 1 | 1 | 1 | A07
- A | 0 | 0 | 1 | 1 | 1 | 1 | 1 | A08
- A | 0 | 0 | 0 | 1 | 1 | 1 | 1 | A09
- A | 0 | 0 | 0 | 0 | 1 | 1 | 1 | A10
- A | 0 | 0 | 0 | 0 | 0 | 1 | 1 | A11
- A | 0 | 0 | 0 | 0 | 0 | 0 | 1 | A12
- Bit Timing
- D-BS-8S-0-11

## Sheet 5 of 15
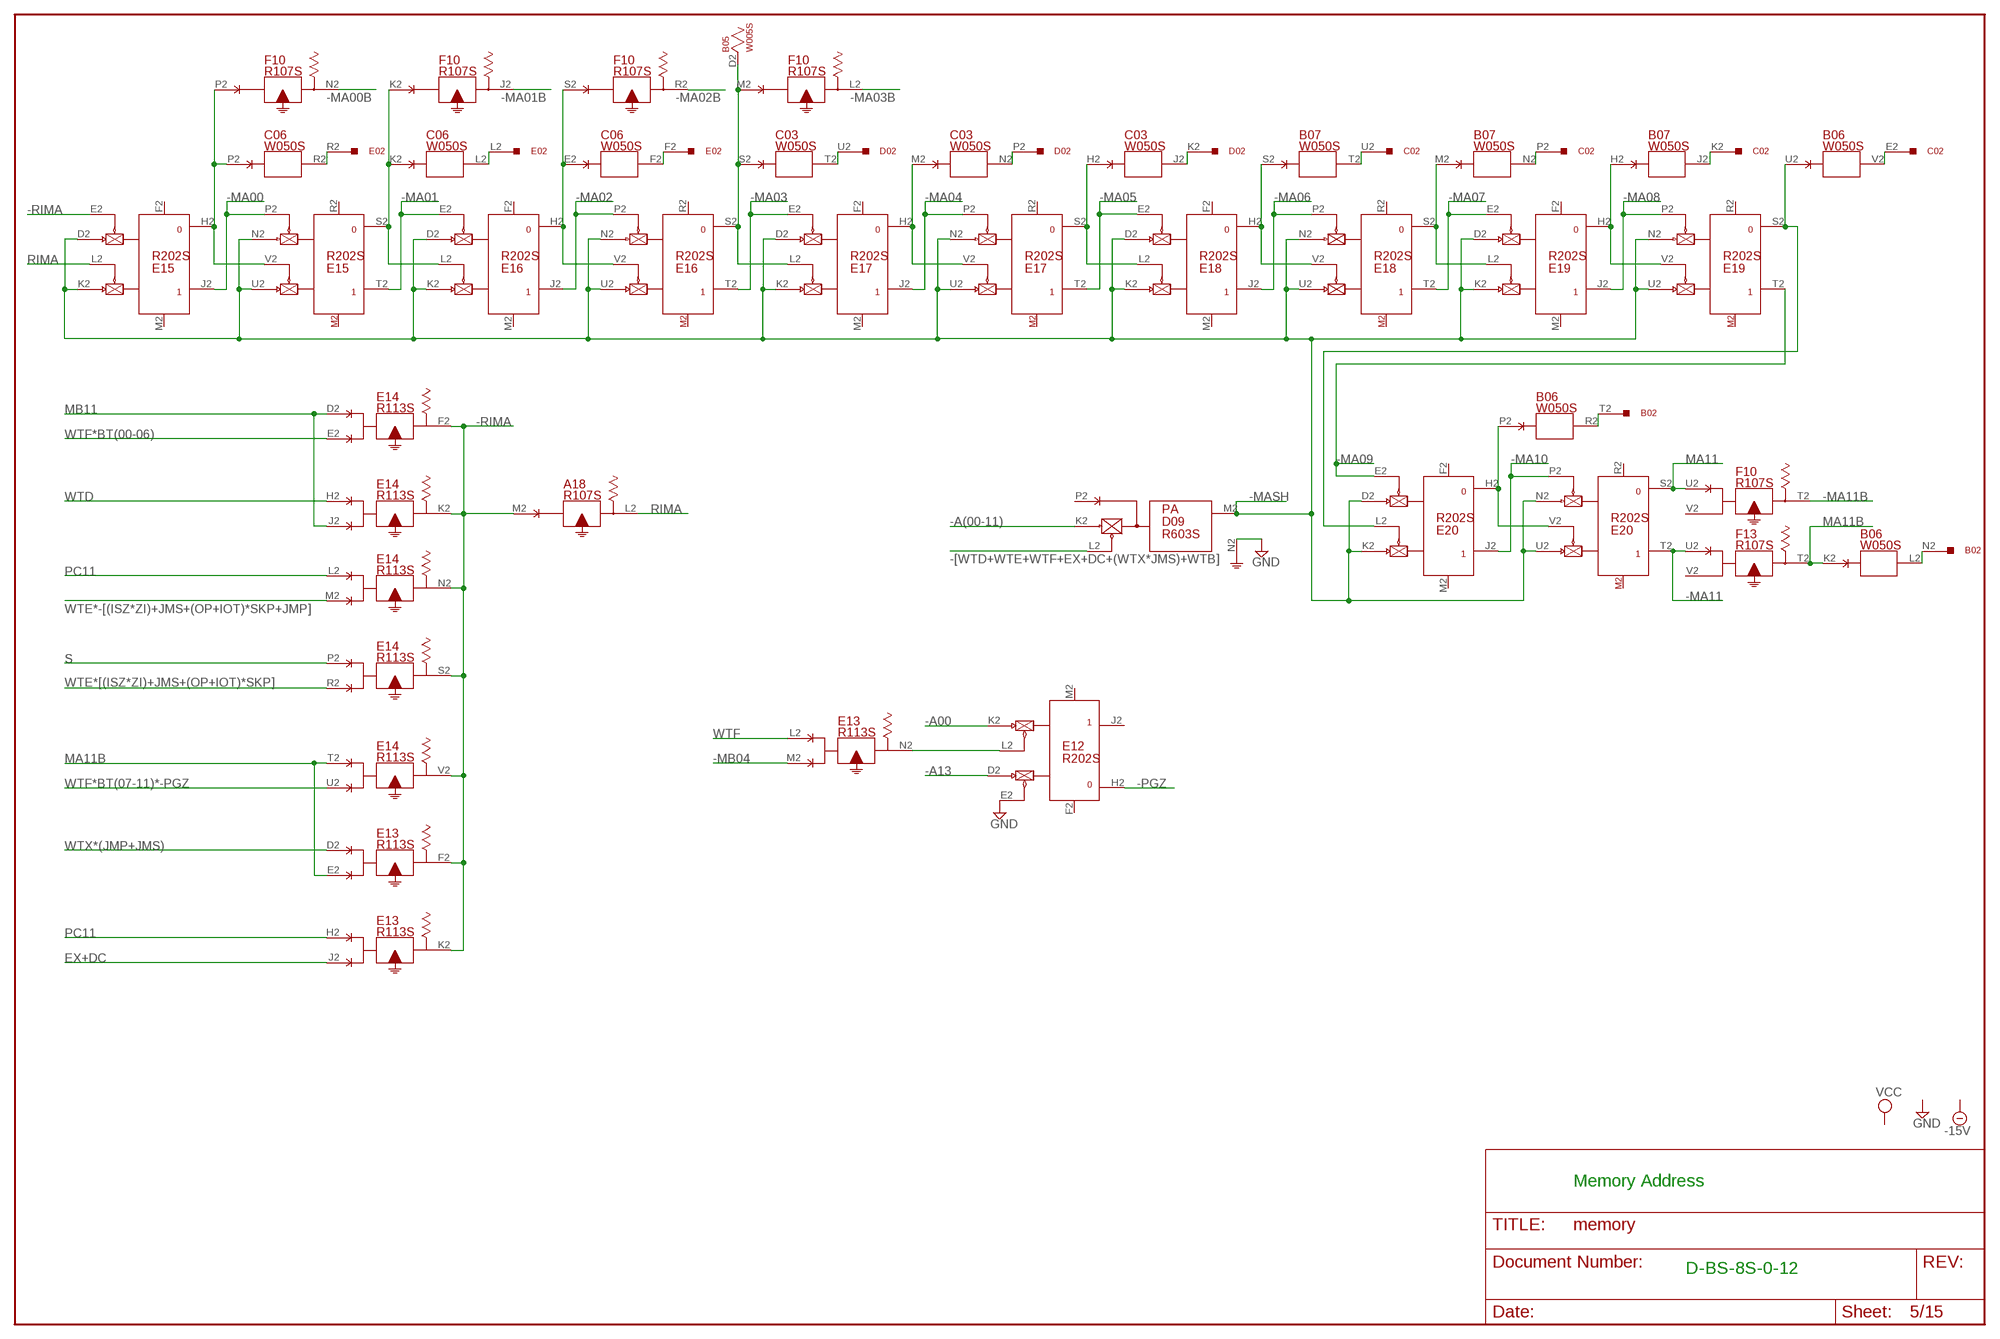
[diagram p4: schematic, sheet 5]

### Parts
A18  R107S  [H807S]
B05  W005S  [H807S]
E12  R202S  [H807S]
E13  R113S  [H807S]
E14  R113S  [H807S]
E15  R202S  [H807S]
E16  R202S  [H807S]
E17  R202S  [H807S]
E18  R202S  [H807S]
E19  R202S  [H807S]
E20  R202S  [H807S]

### Nets
-[WTD+WTE+WTF+EX+DC+(WTX*JMS)+WTB]: D09.L2(M:EN0) ; also sheet 6
-A00: E12.K2(J:PU1) ; also sheet 3,4,9,10,14,15
-A13: E12.D2(J:PU0) ; also sheet 1,4,6,7,10,15
-A(00-11): D09.K2(M:PU0) ; also sheet 1,3,4,7,9,11,12
-MA00: E15.J2 E15.P2(T:EN0) ; also sheet 2,15
-MA00B: F10.N2(N:O$1) ; also sheet 6
-MA01: E15.T2 E16.E2(J:EN0) ; also sheet 2,15
-MA01B: F10.J2(J:O$1) ; also sheet 6
-MA02: E16.J2 E16.P2(T:EN0) ; also sheet 2,15
-MA02B: F10.R2(R:O$1) ; also sheet 6
-MA03: E16.T2 E17.E2(J:EN0) ; also sheet 2,15
-MA03B: F10.L2(L:O$1) ; also sheet 6
-MA04: E17.J2 E17.P2(T:EN0) ; also sheet 2,6,15
-MA05: E17.T2 E18.E2(J:EN0) ; also sheet 2,15
-MA06: E18.J2 E18.P2(T:EN0) ; also sheet 2,15
-MA07: E18.T2 E19.E2(J:EN0) ; also sheet 2,15
-MA08: E19.J2 E19.P2(T:EN0) ; also sheet 2,15
-MA09: E19.T2 E20.E2(J:EN0) ; also sheet 2,15
-MA10: E20.J2 E20.P2(T:EN0) ; also sheet 2,15
-MA11: E20.T2 F13.U2(T:I$1) ; also sheet 2,15
-MA11B: F10.T2(T:O$1)
-MASH: D09.M2(M:O) E15.D2(J:PU0) E15.K2(J:PU1) E15.N2(T:PU0) E15.U2(T:PU1) E16.D2(J:PU0) E16.K2(J:PU1) E16.N2(T:PU0) E16.U2(T:PU1) E17.D2(J:PU0) E17.K2(J:PU1) E17.N2(T:PU0) E17.U2(T:PU1) E18.D2(J:PU0) E18.K2(J:PU1) E18.N2(T:PU0) E18.U2(T:PU1) E19.D2(J:PU0) E19.K2(J:PU1) E19.N2(T:PU0) E19.U2(T:PU1) E20.D2(J:PU0) E20.K2(J:PU1) E20.N2(T:PU0) E20.U2(T:PU1)
-MB04: E13.M2(N:I$2) ; also sheet 1,2,10
-PGZ: E12.H2 ; also sheet 6
-RIMA: A18.M2(L:I$1) E13.F2(F:O$1) E13.K2(K:O$1) E14.F2(F:O$1) E14.K2(K:O$1) E14.N2(N:O$1) E14.S2(S:O$1) E14.V2(V:O$1) E15.E2(J:EN0)
EX+DC: E13.J2(K:I$2) ; also sheet 7,8,9,12
GND [Supply]: D09.N2(M:G) E12.E2(J:EN0) ; also sheet 1,2,3,4,6,7,8,9,10,11,12,14,15
MA11: E20.S2 F10.U2(T:I$1)
MA11B: B06.K2(L:I$1) E13.E2(F:I$2) E14.T2(V:I$1) F13.T2(T:O$1) ; also sheet 11
MB11: E14.D2(F:I$1) E14.J2(K:I$2) ; also sheet 1,6,7,9,12
N$81: C06.P2(R:I$1) E15.H2 E15.V2(T:EN1) F10.P2(N:I$1)
N$82: E12.L2(J:EN1) E13.N2(N:O$1)
N$83: C06.K2(L:I$1) E15.S2 E16.L2(J:EN1) F10.K2(J:I$1)
N$84: C06.E2(F:I$1) E16.H2 E16.V2(T:EN1) F10.S2(R:I$1)
N$86: B05.D2 C03.S2(T:I$1) E16.S2 E17.L2(J:EN1) F10.M2(L:I$1)
N$87: C03.M2(N:I$1) E17.H2 E17.V2(T:EN1)
N$89: C03.H2(J:I$1) E17.S2 E18.L2(J:EN1)
N$90: B07.S2(T:I$1) E18.H2 E18.V2(T:EN1)
N$95: C06.R2(R:O$1) E02.R2
N$97: C06.L2(L:O$1) E02.L2
N$100: C06.F2(F:O$1) E02.F2
N$102: B07.M2(N:I$1) E18.S2 E19.L2(J:EN1)
N$104: C03.T2(T:O$1) D02.U2
N$106: B07.H2(J:I$1) E19.H2 E19.V2(T:EN1)
N$107: B06.U2(V:I$1) E19.S2 E20.L2(J:EN1)
N$109: C03.N2(N:O$1) D02.P2
N$110: B06.P2(R:I$1) E20.H2 E20.V2(T:EN1)
N$112: C03.J2(J:O$1) D02.K2
N$113: B07.T2(T:O$1) C02.U2
N$114: B07.N2(N:O$1) C02.P2
N$115: B07.J2(J:O$1) C02.K2
N$116: B06.V2(V:O$1) C02.E2
N$117: B02.T2 B06.R2(R:O$1)
N$118: B02.N2 B06.L2(L:O$1)
PC11: E13.H2(K:I$1) E14.L2(N:I$1) ; also sheet 1,7,11
RIMA: A18.L2(L:O$1) E15.L2(J:EN1)
S: E14.P2(S:I$1) ; also sheet 1,7,11,12
WTD: E14.H2(K:I$1) ; also sheet 6
WTE*-[(ISZ*ZI)+JMS+(OP+IOT)*SKP+JMP]: E14.M2(N:I$2) ; also sheet 6,11
WTE*[(ISZ*ZI)+JMS+(OP+IOT)*SKP]: E14.R2(S:I$2) ; also sheet 6,11
WTF: E13.L2(N:I$1) ; also sheet 1,3,6,8,10,12
WTF*BT(00-06): E14.E2(F:I$2) ; also sheet 6
WTF*BT(07-11)*-PGZ: E14.U2(V:I$2) ; also sheet 6
WTX*(JMP+JMS): E13.D2(F:I$1) ; also sheet 6,11,15
Unconnected: B05.E2 B05.F2 D09.P2(M:I$1) E12.F2(J:RESET) E12.J2 E12.M2(J:SET) E15.F2(J:RESET) E15.M2(J:SET) E15.R2(T:RESET) E16.F2(J:RESET) E16.M2(J:SET) E16.R2(T:RESET) E17.F2(J:RESET) E17.M2(J:SET) E17.R2(T:RESET) E18.F2(J:RESET) E18.M2(J:SET) E18.R2(T:RESET) E19.F2(J:RESET) E19.M2(J:SET) E19.R2(T:RESET) E20.F2(J:RESET) E20.M2(J:SET) E20.R2(T:RESET) F10.V2(T:I$2) F13.V2(T:I$2)

### Notes on the sheet
- Memory Address
- D-BS-8S-0-12

## Sheet 6 of 15
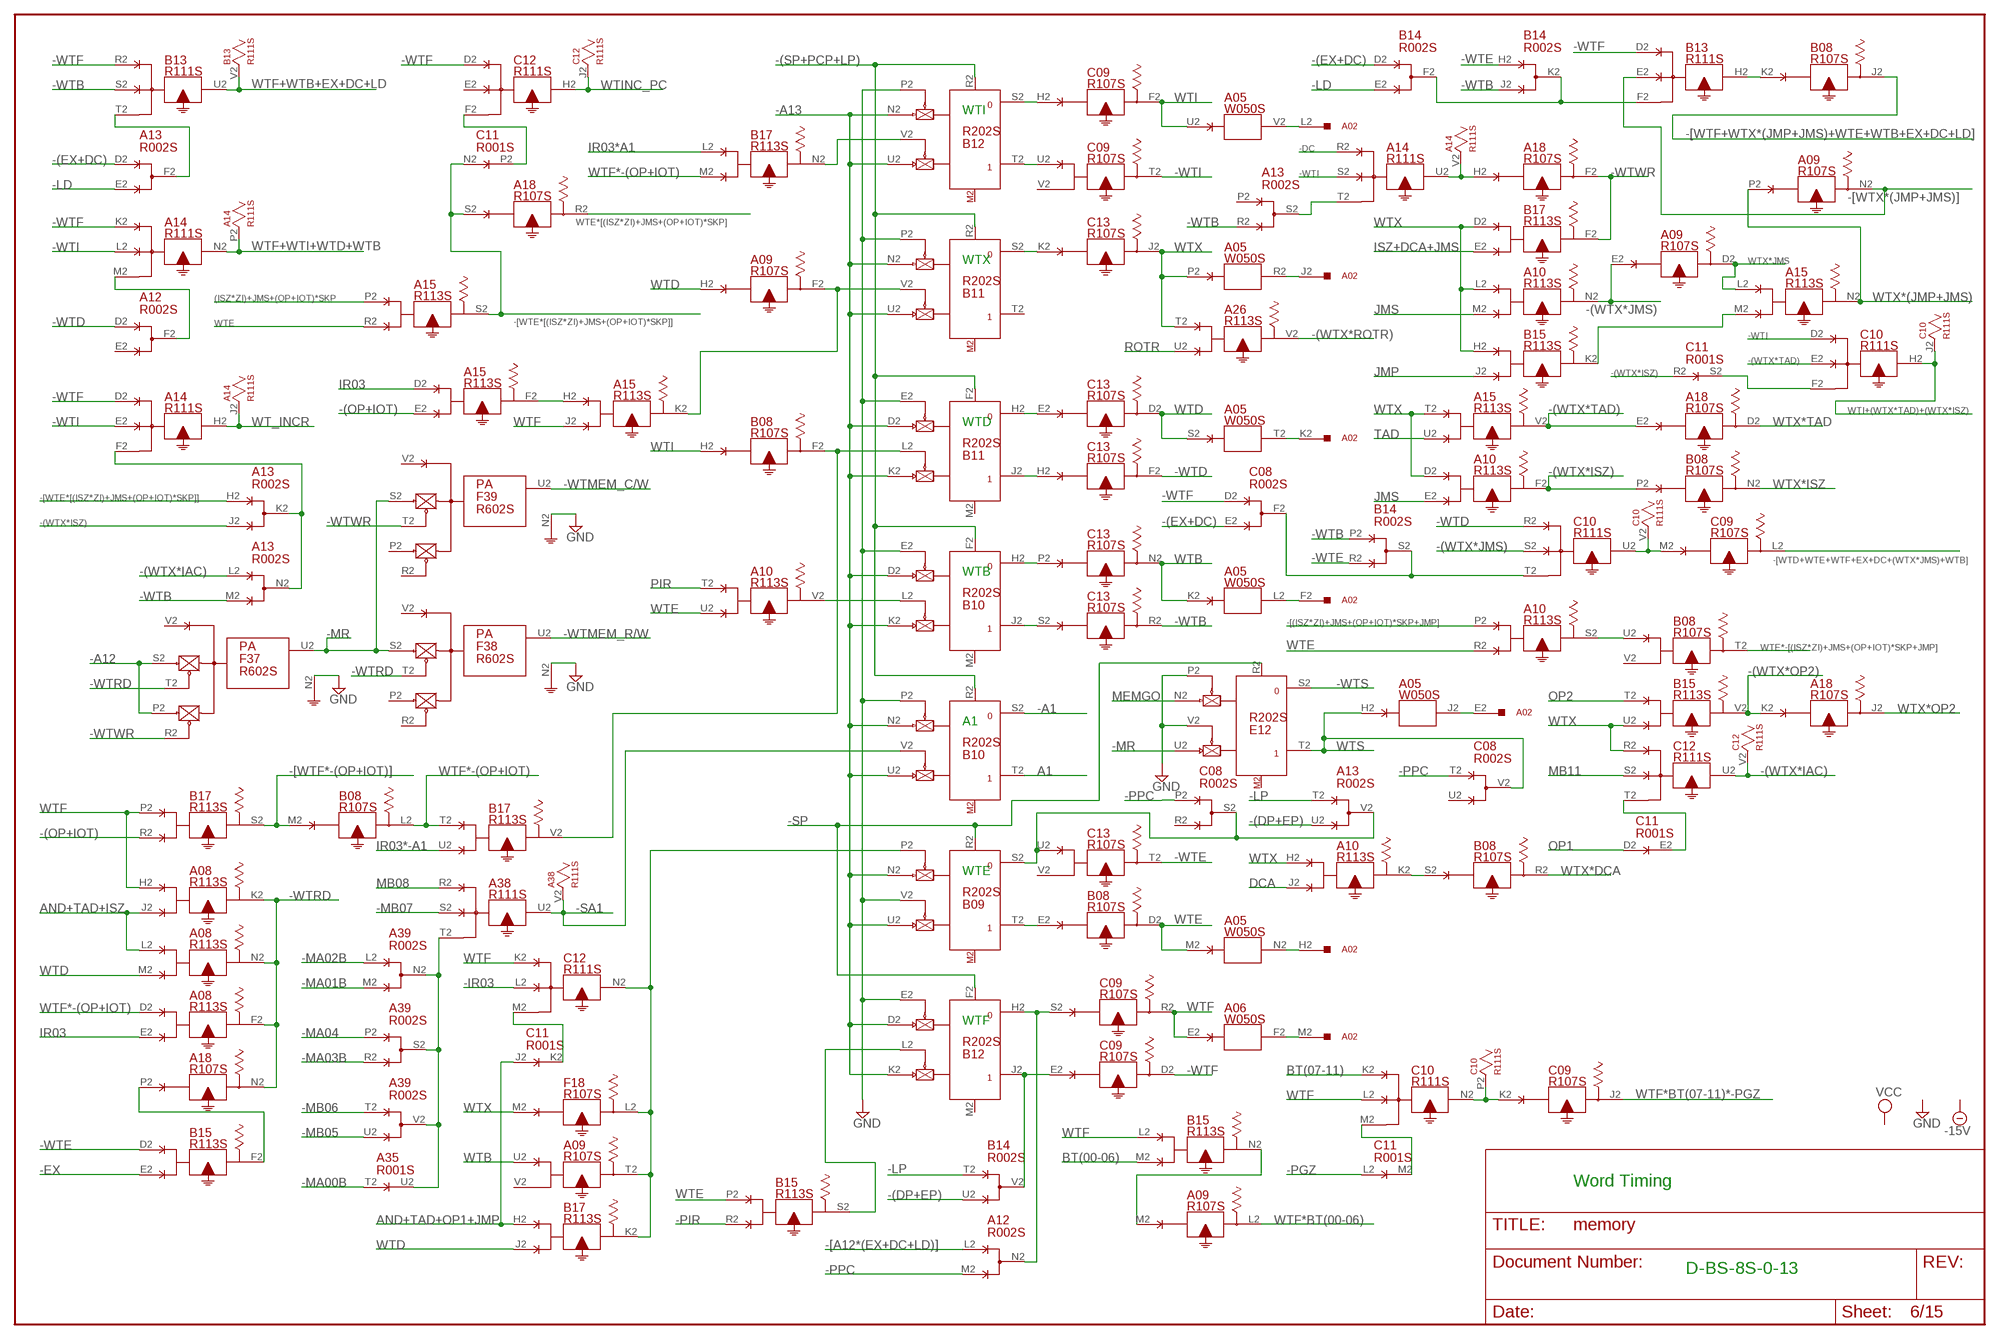
[diagram p5: schematic, sheet 6]

### Parts
A02  W023S  [H807S]
A05  W050S  [H807S]
A06  W050S  [H807S]
A08  R113S  [H807S]
A09  R107S  [H807S]
A10  R113S  [H807S]
A12  R002S  [H807S]
A13  R002S  [H807S]
A14  R111S  [H807S]
A15  R113S  [H807S]
A35  R001S  [H807S]
A38  R111S  [H807S]
A39  R002S  [H807S]
B08  R107S  [H807S]
B09  R202S  [H807S]
B10  R202S  [H807S]
B11  R202S  [H807S]
B12  R202S  [H807S]
B13  R111S  [H807S]
B14  R002S  [H807S]
B15  R113S  [H807S]
B17  R113S  [H807S]
C10  R111S  [H807S]
C11  R001S  [H807S]
C12  R111S  [H807S]
F37  R602S  [H807S]
F38  R602S  [H807S]
F39  R602S  [H807S]

### Nets
(ISZ*ZI)+JMS+(OP+IOT)*SKP: A15.P2(S:I$1) ; also sheet 9
-(DP+EP): A13.U2(V:E) B14.U2(V:E) ; also sheet 4,8,12
-(EX+DC): A13.D2(F:D) B14.D2(F:D) C08.E2(F:E) ; also sheet 8
-(OP+IOT): A15.E2(F:I$2) B17.R2(S:I$2) ; also sheet 1,9
-(SP+PCP+LP): B10.F2(J:RESET) B10.R2(T:RESET) B11.F2(J:RESET) B11.R2(T:RESET) B12.R2(T:RESET) ; also sheet 8,9
-(WTX*IAC): A13.L2(N:D) C12.U2(U:O$1) C12.V2
-(WTX*ISZ): A10.F2(F:O$1) A13.J2(K:E) B08.P2(N:I$1) C11.R2(S:D) ; also sheet 7
-(WTX*JMS): A09.E2(D:I$1) A10.N2(N:O$1) C10.S2(U:I$2)
-(WTX*OP2): A18.K2(J:I$1) B15.V2(V:O$1) ; also sheet 3,7
-(WTX*ROTR): A26.V2(V:O$1) ; also sheet 3,12
-(WTX*TAD): A15.V2(V:O$1) A18.E2(D:I$1) C10.E2(H:I$2) ; also sheet 12
-[(ISZ*ZI)+JMS+(OP+IOT)*SKP+JMP]: A10.P2(S:I$1) ; also sheet 9
-[A12*(EX+DC+LD)]: A12.L2(N:D) ; also sheet 8
-[WTD+WTE+WTF+EX+DC+(WTX*JMS)+WTB]: C09.L2(L:O$1) ; also sheet 5
-[WTE*[(ISZ*ZI)+JMS+(OP+IOT)*SKP]]: A13.H2(K:D) A15.S2(S:O$1) A18.S2(R:I$1) C11.N2(P:D)
-[WTF*-(OP+IOT)]: B08.M2(L:I$1) B17.S2(S:O$1)
-[WTF+WTX*(JMP+JMS)+WTE+WTB+EX+DC+LD]: B08.J2(J:O$1) ; also sheet 11
-[WTX*(JMP+JMS)]: A09.N2(N:O$1) B13.E2(H:I$2) ; also sheet 14
-A1: B10.S2 ; also sheet 9
-A12: F37.P2(U:E) F37.S2(U:H) ; also sheet 1,3,4,8,10,12,15
-A13: B09.N2(T:PU0) B09.U2(T:PU1) B10.D2(J:PU0) B10.K2(J:PU1) B10.N2(T:PU0) B10.U2(T:PU1) B11.D2(J:PU0) B11.K2(J:PU1) B11.N2(T:PU0) B11.U2(T:PU1) B12.D2(J:PU0) B12.K2(J:PU1) B12.N2(T:PU0) B12.U2(T:PU1) ; also sheet 1,4,5,7,10,15
-DC: A14.R2(U:I$1) ; also sheet 8
-EX: B15.E2(F:I$2) ; also sheet 8
-IR03: C12.L2(N:I$2) ; also sheet 9
-LD: A13.E2(F:E) B14.E2(F:E) ; also sheet 8,15
-LP: A13.T2(V:D) B14.T2(V:D) ; also sheet 4,8,12,15
-MA00B: A35.T2(U:D) ; also sheet 5
-MA01B: A39.M2(N:E) ; also sheet 5
-MA02B: A39.L2(N:D) ; also sheet 5
-MA03B: A39.R2(S:E) ; also sheet 5
-MA04: A39.P2(S:D) ; also sheet 2,5,15
-MB05: A39.U2(V:E) ; also sheet 1,2,10
-MB06: A39.T2(V:D) ; also sheet 1,2,7,10
-MB07: A38.S2(U:I$2) ; also sheet 1,2,10
-MR: E12.U2(T:PU1) F37.U2(U:K) F38.S2(U:H) F39.S2(U:H)
-PGZ: C11.L2(M:D) ; also sheet 5
-PIR: B15.R2(S:I$2) ; also sheet 10
-PPC: A12.M2(N:E) C08.P2(S:D) C08.T2(V:D) ; also sheet 4,8,10,11,15
-SA1: A38.U2(U:O$1) A38.V2 B10.V2(T:EN1)
-SP: B09.R2(T:RESET) B12.F2(J:RESET) E12.R2(T:RESET) ; also sheet 1,8
-WTB: A13.M2(N:E) A13.R2(S:E) B13.S2(U:I$2) B14.J2(K:E) B14.P2(S:D) C13.R2(R:O$1) ; also sheet 9,15
-WTD: A12.D2(F:D) C10.R2(U:I$1) C13.F2(F:O$1) ; also sheet 15
-WTE: B14.H2(K:D) B14.R2(S:E) B15.D2(F:I$1) C13.T2(T:O$1) ; also sheet 3
-WTF: A14.D2(H:I$1) A14.K2(N:I$1) B13.D2(H:I$1) B13.R2(U:I$1) C08.D2(F:D) C09.D2(D:O$1) C12.D2(H:I$1) ; also sheet 7,9,15
-WTI: A14.E2(H:I$2) A14.L2(N:I$2) A14.S2(U:I$2) C09.T2(T:O$1) C10.D2(H:I$1)
-WTMEM_C/W: F39.U2(U:K) ; also sheet 13
-WTMEM_R/W: F38.U2(U:K) ; also sheet 1,13
-WTRD: A08.F2(F:O$1) A08.K2(K:O$1) A08.N2(N:O$1) A18.N2(N:O$1) F37.T2(U:J) F38.T2(U:J)
-WTS: E12.S2 ; also sheet 1,4
-WTWR: A18.F2(F:O$1) B17.F2(F:O$1) F37.R2(U:F) F39.T2(U:J) ; also sheet 1
A1: B10.T2 ; also sheet 9
AND+TAD+ISZ: A08.J2(K:I$2) A08.L2(N:I$1) ; also sheet 1,9
AND+TAD+OP1+JMP: B17.H2(K:I$1) C11.J2(K:D) ; also sheet 9
BT(00-06): B15.M2(N:I$2) ; also sheet 4
BT(07-11): C10.K2(N:I$1) ; also sheet 4
DCA: A10.J2(K:I$2) ; also sheet 9
GND [Supply]: B09.V2(T:EN1) B10.E2(J:EN0) B10.P2(T:EN0) B11.E2(J:EN0) B11.P2(T:EN0) B12.E2(J:EN0) B12.P2(T:EN0) E12.P2(T:EN0) E12.V2(T:EN1) F37.N2(U:C) F38.N2(U:C) F39.N2(U:C) ; also sheet 1,2,3,4,5,7,8,9,10,11,12,14,15
IR03: A08.E2(F:I$2) A15.D2(F:I$1) ; also sheet 9
IR03*-A1: B17.U2(V:I$2) ; also sheet 9
IR03*A1: B17.L2(N:I$1) ; also sheet 9
ISZ+DCA+JMS: B17.E2(F:I$2) ; also sheet 9
JMP: B15.J2(K:I$2) ; also sheet 9
JMS: A10.E2(F:I$2) A10.M2(N:I$2) ; also sheet 9
MB08: A38.R2(U:I$1) ; also sheet 1,3,9
MB11: C12.S2(U:I$2) ; also sheet 1,5,7,9,12
MEMGO: E12.N2(T:PU0) ; also sheet 13
N$92: A13.F2(F:F) B13.T2(U:I$3)
N$120: C11.P2(P:E) C12.F2(H:I$3)
N$121: A13.K2(K:F) A13.N2(N:F) A14.F2(H:I$3)
N$122: A15.F2(F:O$1) A15.H2(K:I$1)
N$125: A12.F2(F:F) A14.M2(N:I$3)
N$126: A35.U2(U:E) A38.T2(U:I$3) A39.N2(N:F) A39.S2(S:F) A39.V2(V:F)
N$127: C11.K2(K:E) C12.M2(N:I$3)
N$128: A18.P2(N:I$1) B15.F2(F:O$1)
N$129: B12.S2 C09.H2(F:I$1)
N$130: B12.T2 C09.U2(T:I$1)
N$131: B11.S2 C13.K2(J:I$1)
N$132: B11.H2 C13.E2(D:I$1)
N$133: B11.J2 C13.H2(F:I$1)
N$134: B10.H2 C13.P2(N:I$1)
N$135: B10.J2 C13.S2(R:I$1)
N$136: B12.J2 B14.V2(V:F) C09.E2(D:I$1)
N$137: A09.T2(T:O$1) B09.P2(T:EN0) B17.K2(K:O$1) C12.N2(N:O$1) F18.L2(L:O$1)
N$138: A10.V2(V:O$1) B10.L2(J:EN1)
N$139: B08.F2(F:O$1) B11.L2(J:EN1) B17.V2(V:O$1)
N$140: A09.F2(F:O$1) A15.K2(K:O$1) B11.V2(T:EN1)
N$141: B12.V2(T:EN1) B17.N2(N:O$1)
N$142: B08.E2(D:I$1) B09.T2
N$143: A13.V2(V:F) B09.S2 C08.S2(S:F) C13.U2(T:I$1)
N$144: A12.N2(N:F) B12.H2 C09.S2(R:I$1)
N$145: A02.M2 A06.F2(F:O$1)
N$146: A02.H2 A05.N2(N:O$1)
N$147: A02.F2 A05.L2(L:O$1)
N$148: B12.L2(J:EN1) B15.S2(S:O$1)
N$149: A02.L2 A05.V2(V:O$1)
N$150: A02.J2 A05.R2(R:O$1)
N$151: A02.K2 A05.T2(T:O$1)
N$152: A14.U2(U:O$1) A14.V2 A18.H2(F:I$1)
N$153: A15.M2(N:I$2) B15.K2(K:O$1)
N$154: A13.S2(S:F) A14.T2(U:I$3)
N$155: B08.K2(J:I$1) B13.H2(H:O$1)
N$156: B13.F2(H:I$3) B14.F2(F:F) B14.K2(K:F)
N$157: B14.S2(S:F) C08.F2(F:F) C10.T2(U:I$3)
N$158: C09.M2(L:I$1) C10.U2(U:O$1) C10.V2
N$159: C10.F2(H:I$3) C11.S2(S:E)
N$160: A02.E2 A05.J2(J:O$1)
N$161: A10.S2(S:O$1) B08.U2(T:I$1)
N$162: A09.M2(L:I$1) B15.N2(N:O$1)
N$163: C10.M2(N:I$3) C11.M2(M:E)
N$164: C09.K2(J:I$1) C10.N2(N:O$1) C10.P2
N$166: A10.K2(K:O$1) B08.S2(R:I$1)
N$168: C11.E2(E:E) C12.T2(U:I$3)
OP1: C11.D2(E:D) ; also sheet 7,9,12
OP2: B15.T2(V:I$1) ; also sheet 3,7,8,9,12
PIR: A10.T2(V:I$1) ; also sheet 10
ROTR: A26.U2(V:I$2) ; also sheet 9
TAD: A15.U2(V:I$2) ; also sheet 9
WT_INCR: A14.H2(H:O$1) A14.J2 ; also sheet 7
WTB: A05.K2(L:I$1) A09.U2(T:I$1) C13.N2(N:O$1) ; also sheet 1
WTD: A05.S2(T:I$1) A08.M2(N:I$2) A09.H2(F:I$1) B17.J2(K:I$2) C13.D2(D:O$1) ; also sheet 5
WTE: A05.M2(N:I$1) A10.R2(S:I$2) A10.U2(V:I$2) A15.R2(S:I$2) B08.D2(D:O$1) B15.P2(S:I$1) ; also sheet 1,3,8
WTE*-[(ISZ*ZI)+JMS+(OP+IOT)*SKP+JMP]: B08.T2(T:O$1) ; also sheet 5,11
WTE*[(ISZ*ZI)+JMS+(OP+IOT)*SKP]: A18.R2(R:O$1) ; also sheet 5,11
WTF: A06.E2(F:I$1) A08.H2(K:I$1) A15.J2(K:I$2) B15.L2(N:I$1) B17.P2(S:I$1) C09.R2(R:O$1) C10.L2(N:I$2) C12.K2(N:I$1) ; also sheet 1,3,5,8,10,12
WTF*-(OP+IOT): A08.D2(F:I$1) B08.L2(L:O$1) B17.M2(N:I$2) B17.T2(V:I$1)
WTF*BT(00-06): A09.L2(L:O$1) ; also sheet 5
WTF*BT(07-11)*-PGZ: C09.J2(J:O$1) ; also sheet 5
WTF+WTB+EX+DC+LD: B13.U2(U:O$1) B13.V2 ; also sheet 11
WTF+WTI+WTD+WTB: A14.N2(N:O$1) A14.P2 ; also sheet 1
WTI: A05.U2(V:I$1) B08.H2(F:I$1) C09.F2(F:O$1) ; also sheet 1
WTI+(WTX*TAD)+(WTX*ISZ): C10.H2(H:O$1) C10.J2 ; also sheet 7
WTINC_PC: C12.H2(H:O$1) C12.J2 ; also sheet 7
WTS: A05.H2(J:I$1) C08.V2(V:F) E12.T2 ; also sheet 8
WTX: A05.P2(R:I$1) A10.D2(F:I$1) A10.H2(K:I$1) A10.L2(N:I$1) A15.T2(V:I$1) A26.T2(V:I$1) B15.H2(K:I$1) B15.U2(V:I$2) B17.D2(F:I$1) C12.R2(U:I$1) C13.J2(J:O$1) F18.M2(L:I$1) ; also sheet 1,3,7,10,12,15
WTX*(JMP+JMS): A09.P2(N:I$1) A15.N2(N:O$1) ; also sheet 5,11,15
WTX*DCA: B08.R2(R:O$1) ; also sheet 1
WTX*ISZ: B08.N2(N:O$1) ; also sheet 1
WTX*JMS: A09.D2(D:O$1) A15.L2(N:I$1) ; also sheet 1
WTX*OP2: A18.J2(J:O$1) ; also sheet 12
WTX*TAD: A18.D2(D:O$1) ; also sheet 7
Unconnected: A02.A2 A02.B2 A02.C2 A09.V2(T:I$2) A12.E2(F:E) A12.H2(K:D) A12.J2(K:E) A12.K2(K:F) A13.P2(S:D) B08.V2(T:I$2) B10.M2(J:SET) B11.M2(J:SET) B11.T2 B12.M2(J:SET) B13.J2 C08.R2(S:E) C08.U2(V:E) C09.V2(T:I$2) C12.E2(H:I$2) C12.P2 C13.V2(T:I$2) F37.V2(U:L) F38.P2(U:E) F38.R2(U:F) F38.V2(U:L) F39.P2(U:E) F39.R2(U:F) F39.V2(U:L)

### Notes on the sheet
- WTI
- WTX
- WTD
- WTB
- A1
- WTE
- WTF
- Word Timing
- D-BS-8S-0-13

## Sheet 7 of 15
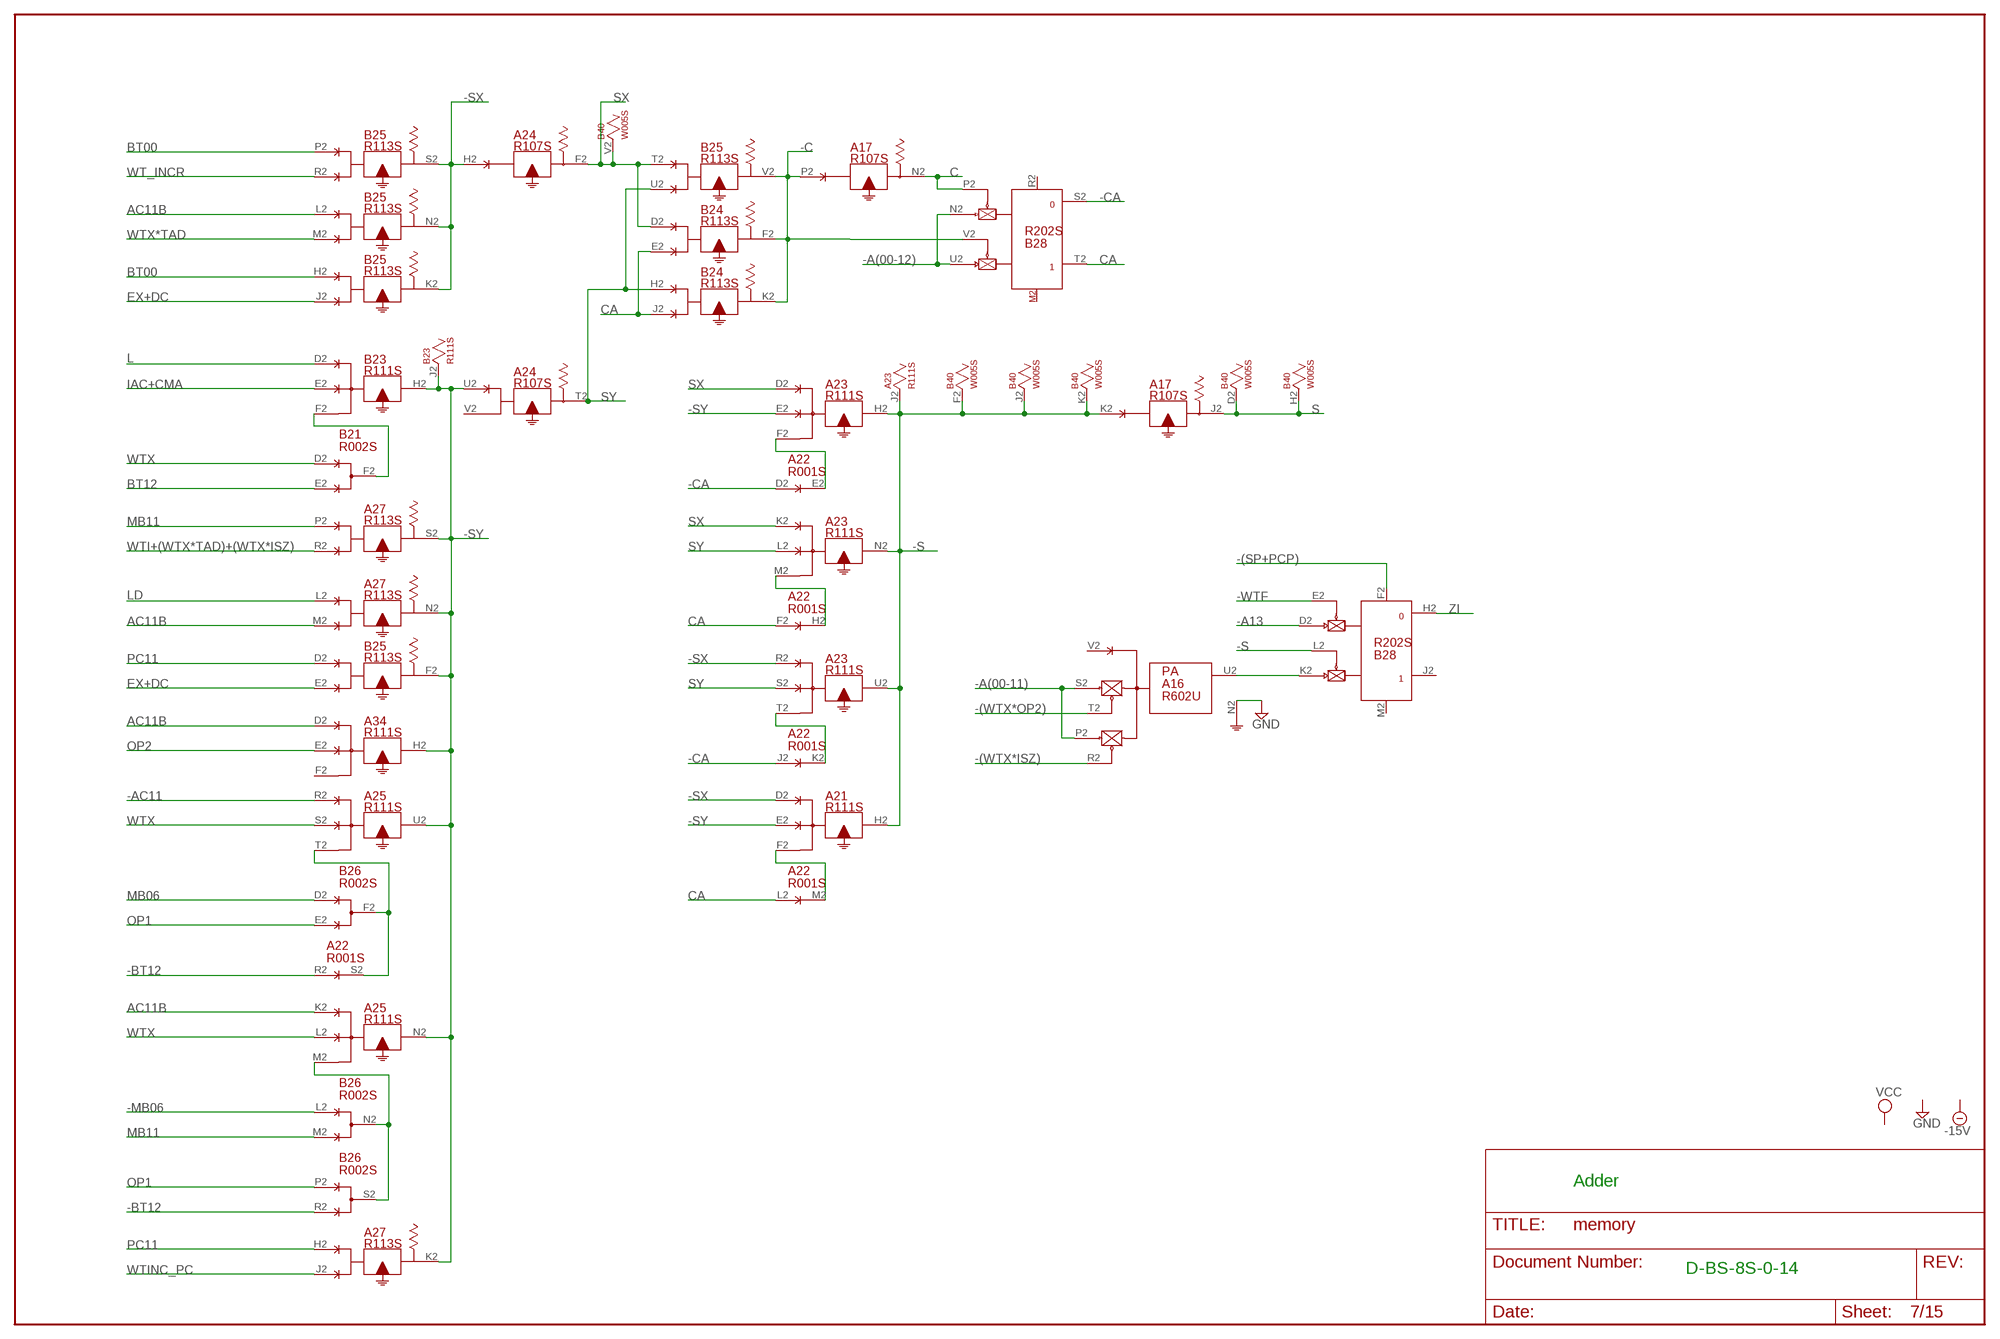
[diagram p6: schematic, sheet 7]

### Parts
A16  R602U  R602S  [H807S]
A23  R111S  [H807S]
A25  R111S  [H807S]
A34  R111S  [H807S]
B21  R002S  [H807S]
B24  R113S  [H807S]
B25  R113S  [H807S]
B28  R202S  [H807S]

### Nets
-(SP+PCP): B28.F2(J:RESET) ; also sheet 1,3,8,10,12,14,15
-(WTX*ISZ): A16.R2(U:F) ; also sheet 6
-(WTX*OP2): A16.T2(U:J) ; also sheet 3,6
-A13: B28.D2(J:PU0) ; also sheet 1,4,5,6,10,15
-A(00-11): A16.P2(U:E) A16.S2(U:H) ; also sheet 1,3,4,5,9,11,12
-A(00-12): B28.N2(T:PU0) B28.U2(T:PU1) ; also sheet 4
-AC11: A25.R2(U:I$1) ; also sheet 12
-BT12: A22.R2(S:D) B26.R2(S:E) ; also sheet 4
-C: A17.P2(N:I$1) B24.F2(F:O$1) B24.K2(K:O$1) B25.V2(V:O$1) B28.V2(T:EN1)
-CA: A22.D2(E:D) A22.J2(K:D) B28.S2
-MB06: B26.L2(N:D) ; also sheet 1,2,6,10
-S: A17.K2(J:I$1) A21.H2(H:O$1) A23.H2(H:O$1) A23.J2 A23.N2(N:O$1) A23.U2(U:O$1) B28.L2(J:EN1) B40.F2 B40.J2 B40.K2
-SX: A21.D2(H:I$1) A23.R2(U:I$1) A24.H2(F:I$1) B25.K2(K:O$1) B25.N2(N:O$1) B25.S2(S:O$1)
-SY: A21.E2(H:I$2) A23.E2(H:I$2) A24.U2(T:I$1) A25.N2(N:O$1) A25.U2(U:O$1) A27.K2(K:O$1) A27.N2(N:O$1) A27.S2(S:O$1) A34.H2(H:O$1) B23.H2(H:O$1) B23.J2 B25.F2(F:O$1)
-WTF: B28.E2(J:EN0) ; also sheet 6,9,15
AC11B: A25.K2(N:I$1) A27.M2(N:I$2) A34.D2(H:I$1) B25.L2(N:I$1) ; also sheet 1,12
BT00: B25.H2(K:I$1) B25.P2(S:I$1) ; also sheet 4,9,15
BT12: B21.E2(F:E) ; also sheet 4
C: A17.N2(N:O$1) B28.P2(T:EN0)
CA: A22.F2(H:D) A22.L2(M:D) B24.E2(F:I$2) B24.J2(K:I$2) B28.T2
EX+DC: B25.E2(F:I$2) B25.J2(K:I$2) ; also sheet 5,8,9,12
GND [Supply]: A16.N2(U:C) ; also sheet 1,2,3,4,5,6,8,9,10,11,12,14,15
IAC+CMA: B23.E2(H:I$2) ; also sheet 9,12
L: B23.D2(H:I$1) ; also sheet 3,12
LD: A27.L2(N:I$1) ; also sheet 8,12
MB06: B26.D2(F:D) ; also sheet 1,3,9
MB11: A27.P2(S:I$1) B26.M2(N:E) ; also sheet 1,5,6,9,12
N$165: B21.F2(F:F) B23.F2(H:I$3)
N$167: A16.U2(U:K) B28.K2(J:PU1)
N$169: A22.S2(S:E) A25.T2(U:I$3) B26.F2(F:F)
N$170: A22.E2(E:E) A23.F2(H:I$3)
N$171: A25.M2(N:I$3) B26.N2(N:F) B26.S2(S:F)
N$172: A22.H2(H:E) A23.M2(N:I$3)
N$174: A22.K2(K:E) A23.T2(U:I$3)
N$175: A21.F2(H:I$3) A22.M2(M:E)
OP1: B26.E2(F:E) B26.P2(S:D) ; also sheet 6,9,12
OP2: A34.E2(H:I$2) ; also sheet 3,6,8,9,12
PC11: A27.H2(K:I$1) B25.D2(F:I$1) ; also sheet 1,5,11
S: A17.J2(J:O$1) B40.D2 B40.H2 ; also sheet 1,5,11,12
SX: A23.D2(H:I$1) A23.K2(N:I$1) A24.F2(F:O$1) B24.D2(F:I$1) B25.T2(V:I$1) B40.V2
SY: A23.L2(N:I$2) A23.S2(U:I$2) A24.T2(T:O$1) B24.H2(K:I$1) B25.U2(V:I$2)
WT_INCR: B25.R2(S:I$2) ; also sheet 6
WTI+(WTX*TAD)+(WTX*ISZ): A27.R2(S:I$2) ; also sheet 6
WTINC_PC: A27.J2(K:I$2) ; also sheet 6
WTX: A25.L2(N:I$2) A25.S2(U:I$2) B21.D2(F:D) ; also sheet 1,3,6,10,12,15
WTX*TAD: B25.M2(N:I$2) ; also sheet 6
ZI: B28.H2 ; also sheet 3,9
Unconnected: A16.V2(U:L) A23.P2 A23.V2 A24.V2(T:I$2) A25.P2 A25.V2 A34.F2(H:I$3) A34.J2 A34.V2 B28.J2 B28.M2(J:SET) B28.R2(T:RESET)

### Notes on the sheet
- Adder
- D-BS-8S-0-14

## Sheet 8 of 15
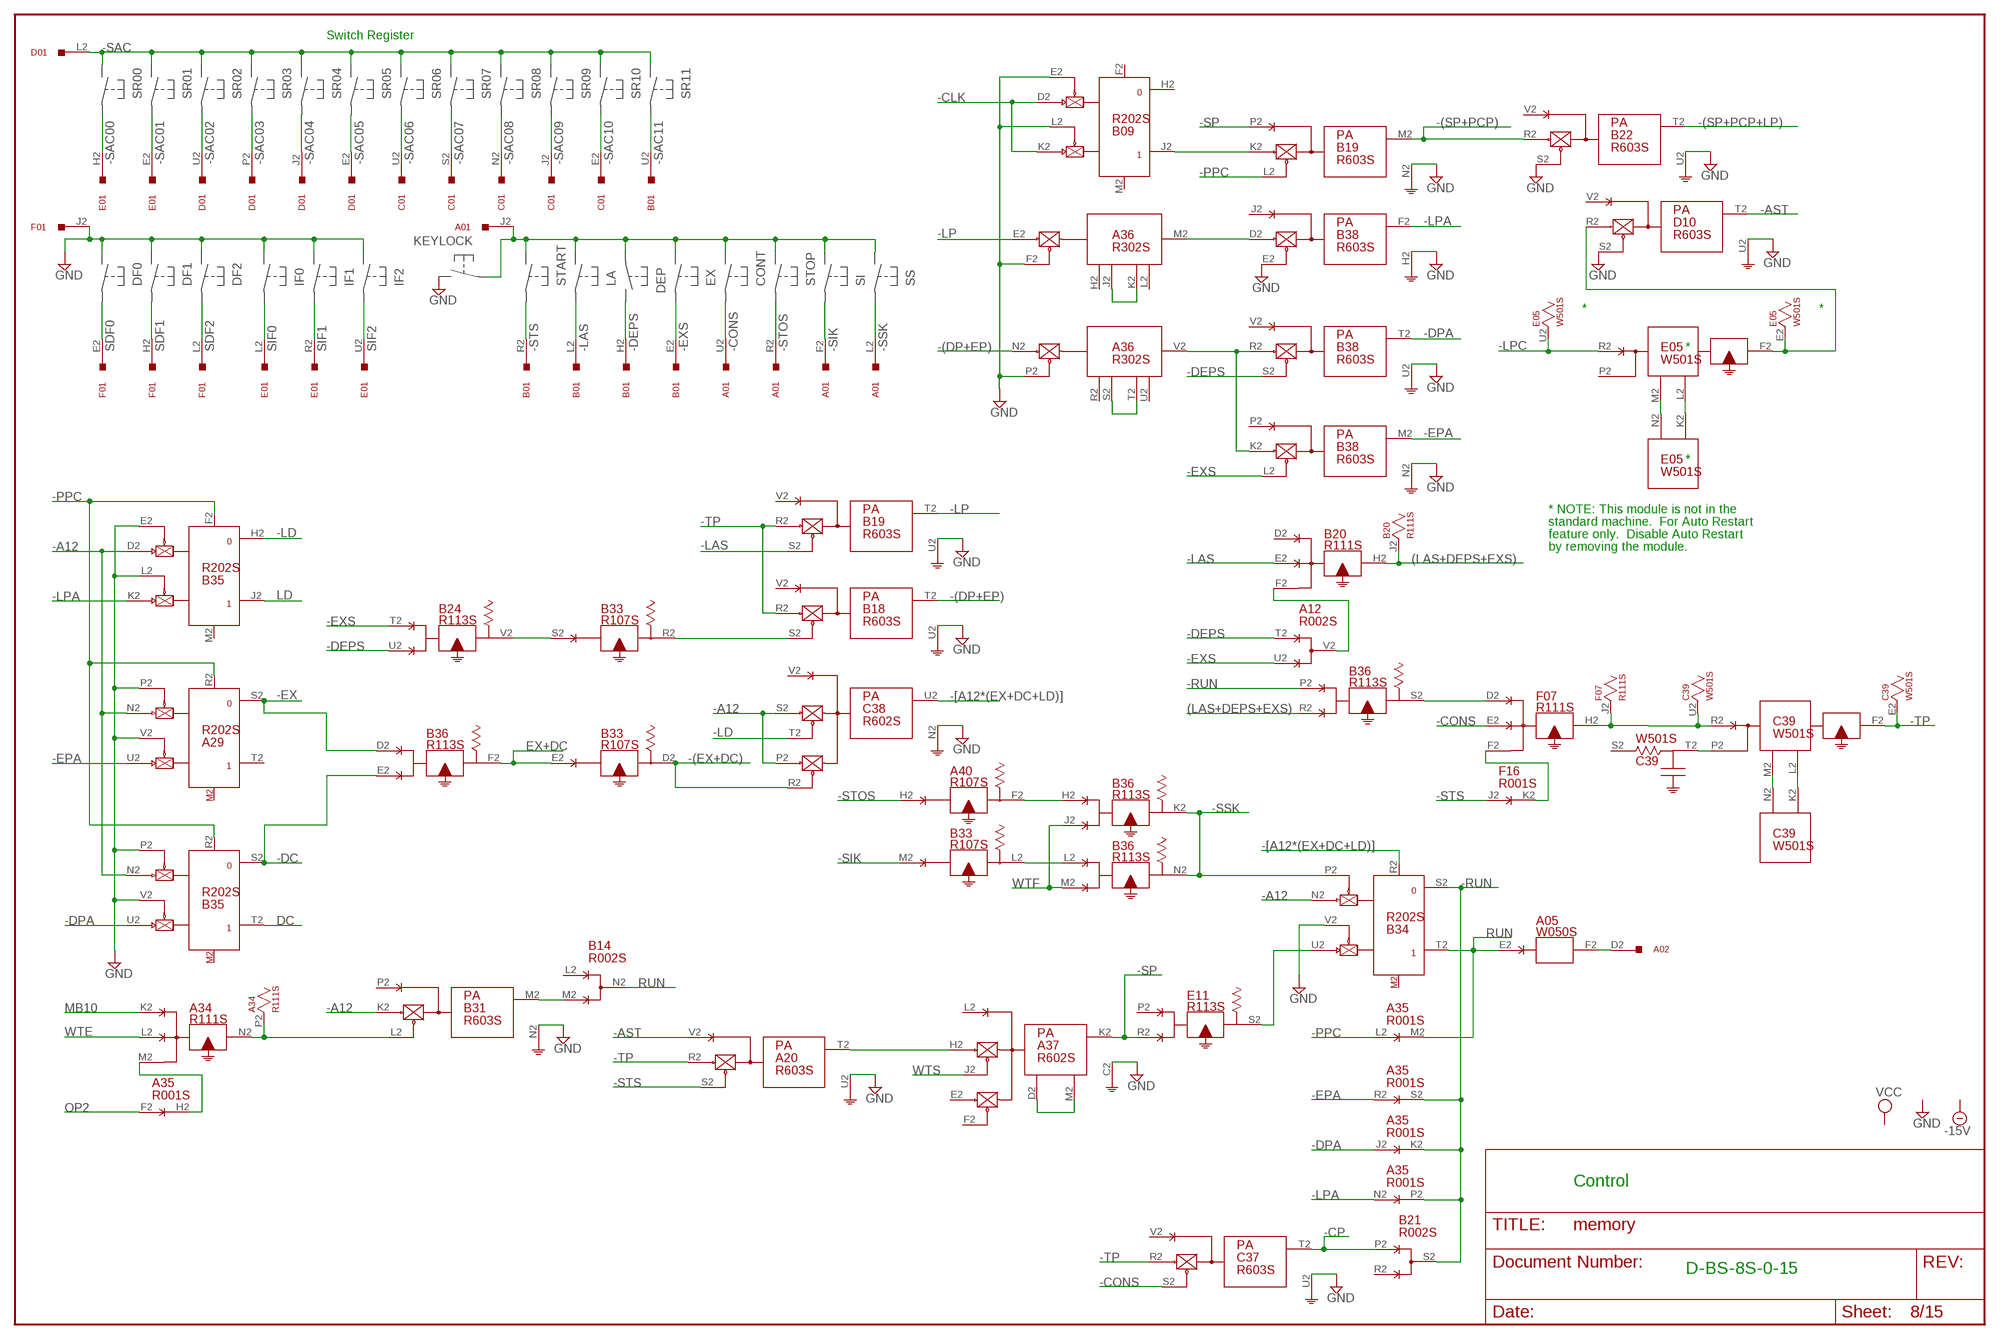
[diagram p7: schematic, sheet 8]

### Parts
A01  W023S  [H807S]
A36  R302S  [H807S]
A37  R602S  [H807S]
A40  R107S  [H807S]
B01  W023S  [H807S]
B18  R603S  [H807S]
B19  R603S  [H807S]
B20  R111S  [H807S]
B22  R603S  [H807S]
B34  R202S  [H807S]
B35  R202S  [H807S]
B36  R113S  [H807S]
B38  R603S  [H807S]
C01  W023S  [H807S]
C38  R602S  [H807S]
C39  W501S  [H807S]
D01  W023S  [H807S]
E01  W023S  [H807S]
E05  W501S  [H807S]
E11  R113S  [H807S]
F01  W023S  [H807S]
F16  R001S  [H807S]

### Nets
(LAS+DEPS+EXS): B20.H2(H:O$1) B20.J2 B36.R2(S:I$2)
-(DP+EP): A36.N2(V:E) B18.T2(T:O) ; also sheet 4,6,12
-(EX+DC): B33.D2(D:O$1) C38.R2(U:F) ; also sheet 6
-(SP+PCP): B19.M2(M:O) B22.R2(T:PU0) ; also sheet 1,3,7,10,12,14,15
-(SP+PCP+LP): B22.T2(T:O) ; also sheet 6,9
-[A12*(EX+DC+LD)]: B34.R2(T:RESET) C38.U2(U:K) ; also sheet 6
-A12: A29.N2(T:PU0) B31.K2(M:PU0) B34.N2(T:PU0) B35.D2(J:PU0) B35.N2(T:PU0) C38.P2(U:E) C38.S2(U:H) ; also sheet 1,3,4,6,10,12,15
-AST: A20.V2(T:I$1) D10.T2(T:O)
-CLK: B09.D2(J:PU0) B09.K2(J:PU1) ; also sheet 4,15
-CONS: A01.U2 C37.S2(T:EN0) F07.E2(H:I$2)
-CP: B21.P2(S:D) C37.T2(T:O)
-DC: B35.S2 B36.E2(F:I$2) ; also sheet 6
-DEPS: A12.T2(V:D) B01.H2 B24.U2(V:I$2) B38.S2(T:EN0)
-DPA: A35.J2(K:D) B35.U2(T:PU1) B38.T2(T:O) ; also sheet 3
-EPA: A29.U2(T:PU1) A35.R2(S:D) B38.M2(M:O) ; also sheet 1
-EX: A29.S2 B36.D2(F:I$1) ; also sheet 6
-EXS: A12.U2(V:E) B01.E2 B24.T2(V:I$1) B38.L2(M:EN0)
-LAS: B01.L2 B19.S2(T:EN0) B20.E2(H:I$2)
-LD: B35.H2 C38.T2(U:J) ; also sheet 6,15
-LP: A36.E2(M:E) B19.T2(T:O) ; also sheet 4,6,12,15
-LPA: A35.N2(P:D) B35.K2(J:PU1) B38.F2(F:O) ; also sheet 3
-LPC: E05.R2(F:R) E05.U2 ; also sheet 10
-PPC: A29.R2(T:RESET) A35.L2(M:D) B19.L2(M:EN0) B35.F2(J:RESET) B35.R2(T:RESET) ; also sheet 4,6,10,11,15
-RUN: A35.K2(K:E) A35.P2(P:E) A35.S2(S:E) B21.S2(S:F) B34.S2 B36.P2(S:I$1) ; also sheet 4,10
-SAC: D01.L2 ; also sheet 3
-SAC00: E01.H2 ; also sheet 12
-SAC01: E01.E2 ; also sheet 12
-SAC02: D01.U2 ; also sheet 12
-SAC03: D01.P2 ; also sheet 12
-SAC04: D01.J2 ; also sheet 12
-SAC05: D01.E2 ; also sheet 12
-SAC06: C01.U2 ; also sheet 12
-SAC07: C01.S2 ; also sheet 12
-SAC08: C01.N2 ; also sheet 12
-SAC09: C01.J2 ; also sheet 12
-SAC10: C01.E2 ; also sheet 12
-SAC11: B01.U2 ; also sheet 12
-SIK: A01.F2 B33.M2(L:I$1)
-SP: A37.K2(K:K) B19.P2(M:I$1) E11.R2(S:I$2) ; also sheet 1,6
-SSK: A01.L2 B34.P2(T:EN0) B36.K2(K:O$1) B36.N2(N:O$1)
-STOS: A01.R2 A40.H2(F:I$1)
-STS: A20.S2(T:EN0) B01.R2 F16.J2(K:D)
-TP: A20.R2(T:PU0) B18.R2(T:PU0) B19.R2(T:PU0) C37.R2(T:PU0) C39.E2 C39.F2(F:F)
DC: B35.T2 ; also sheet 1,12
EX+DC: B33.E2(D:I$1) B36.F2(F:O$1) ; also sheet 5,7,9,12
GND [Supply]: A20.U2(T:G) A29.P2(T:EN0) A29.V2(T:EN1) A36.F2(M:F) A36.P2(V:F) A37.C2(K:GND) B09.E2(J:EN0) B09.L2(J:EN1) B18.U2(T:G) B19.N2(M:G) B19.U2(T:G) B22.S2(T:EN0) B22.U2(T:G) B31.N2(M:G) B34.V2(T:EN1) B35.E2(J:EN0) B35.L2(J:EN1) B35.P2(T:EN0) B35.V2(T:EN1) B38.E2(F:EN0) B38.H2(F:G) B38.N2(M:G) B38.U2(T:G) C37.U2(T:G) C38.N2(U:C) D10.S2(T:EN0) D10.U2(T:G) F01.J2 ; also sheet 1,2,3,4,5,6,7,9,10,11,12,14,15
KEYLOCK: A01.J2
LD: B35.J2 ; also sheet 7,12
MB10: A34.K2(N:I$1) ; also sheet 1,9
N$177: A34.M2(N:I$3) A35.H2(H:E)
N$178: A34.N2(N:O$1) A34.P2 B31.L2(M:EN0)
N$179: B14.M2(N:E) B31.M2(M:O)
N$180: B24.V2(V:O$1) B33.S2(R:I$1)
N$181: B34.U2(T:PU1) E11.S2(S:O$1)
N$182: B18.S2(T:EN0) B33.R2(R:O$1)
N$183: A36.S2(V:J) A36.T2(V:K)
N$184: A36.J2(M:J) A36.K2(M:K)
N$185: E05.M2(F:M) E05.N2(K:N)
N$186: E05.K2(K:K) E05.L2(F:L)
N$187: B09.J2 B19.K2(M:PU0)
N$188: D10.R2(T:PU0) E05.E2 E05.F2(F:F)
N$189: A36.M2(M:M) B38.D2(F:PU0)
N$190: A36.V2(V:M) B38.K2(M:PU0) B38.R2(T:PU0)
N$191: A12.V2(V:F) B20.F2(H:I$3)
N$192: C39.M2(F:M) C39.N2(K:N)
N$193: C39.K2(K:K) C39.L2(F:L)
N$194: C39.P2(F:P) C39.T2(T:T)
N$195: C39.R2(F:R) C39.U2 F07.H2(H:O$1) F07.J2
N$196: B36.S2(S:O$1) F07.D2(H:I$1)
N$197: F07.F2(H:I$3) F16.K2(K:E)
N$198: A02.D2 A05.F2(F:O$1)
N$200: B33.L2(L:O$1) B36.L2(N:I$1)
N$201: A40.F2(F:O$1) B36.H2(K:I$1)
N$202: A37.D2(K:D) A37.M2(K:M)
N$203: A20.T2(T:O) A37.H2(K:H)
OP2: A35.F2(H:D) ; also sheet 3,6,7,9,12
RUN: A05.E2(F:I$1) A35.M2(M:E) B14.N2(N:F) B34.T2
SDF0: F01.E2 ; also sheet 15
SDF1: F01.H2 ; also sheet 15
SDF2: F01.L2 ; also sheet 15
SIF0: E01.L2 ; also sheet 15
SIF1: E01.R2 ; also sheet 15
SIF2: E01.U2 ; also sheet 15
WTE: A34.L2(N:I$2) ; also sheet 1,3,6
WTF: B36.J2(K:I$2) B36.M2(N:I$2) ; also sheet 1,3,5,6,10,12
WTS: A37.J2(K:J) ; also sheet 6
Unconnected: A01.A2 A01.B2 A01.C2 A01.D2 A01.E2 A01.H2 A01.K2 A01.M2 A01.N2 A01.P2 A01.S2 A01.T2 A01.V2 A29.T2 A36.H2(M:H) A36.L2(M:L) A36.R2(V:H) A36.U2(V:L) A37.E2(K:E) A37.F2(K:F) A37.L2(K:L) B01.A2 B01.B2 B01.C2 B01.D2 B01.F2 B01.J2 B01.K2 B01.M2 B01.N2 B01.P2 B01.S2 B01.T2 B01.V2 B09.F2(J:RESET) B09.H2 B09.M2(J:SET) B14.L2(N:D) B18.V2(T:I$1) B19.V2(T:I$1) B20.D2(H:I$1) B21.R2(S:E) B22.V2(T:I$1) B31.P2(M:I$1) B35.M2(J:SET) B38.J2(F:I$1) B38.P2(M:I$1) B38.V2(T:I$1) C01.A2 C01.B2 C01.C2 C01.D2 C01.F2 C01.H2 C01.K2 C01.L2 C01.M2 C01.P2 C01.R2 C01.T2 C01.V2 C37.V2(T:I$1) C38.V2(U:L) C39.D2 C39.S2(T:S) D01.A2 D01.B2 D01.C2 D01.D2 D01.F2 D01.H2 D01.K2 D01.M2 D01.N2 D01.R2 D01.S2 D01.T2 D01.V2 D10.V2(T:I$1) E01.A2 E01.B2 E01.C2 E01.D2 E01.F2 E01.J2 E01.K2 E01.M2 E01.N2 E01.P2 E01.S2 E01.T2 E01.V2 E05.D2 E05.P2(F:P) E05.S2(T:S) E05.T2(T:T) E11.P2(S:I$1) F01.A2 F01.B2 F01.C2 F01.D2 F01.F2 F01.K2 F01.M2 F01.N2 F01.P2 F01.R2 F01.S2 F01.T2 F01.U2 F01.V2

### Notes on the sheet
- Switch Register
- * | *
- *
- *
- * NOTE: This module is not in the
- standard machine.  For Auto Restart
- feature only.  Disable Auto Restart
- by removing the module.
- Control
- D-BS-8S-0-15

## Sheet 9 of 15
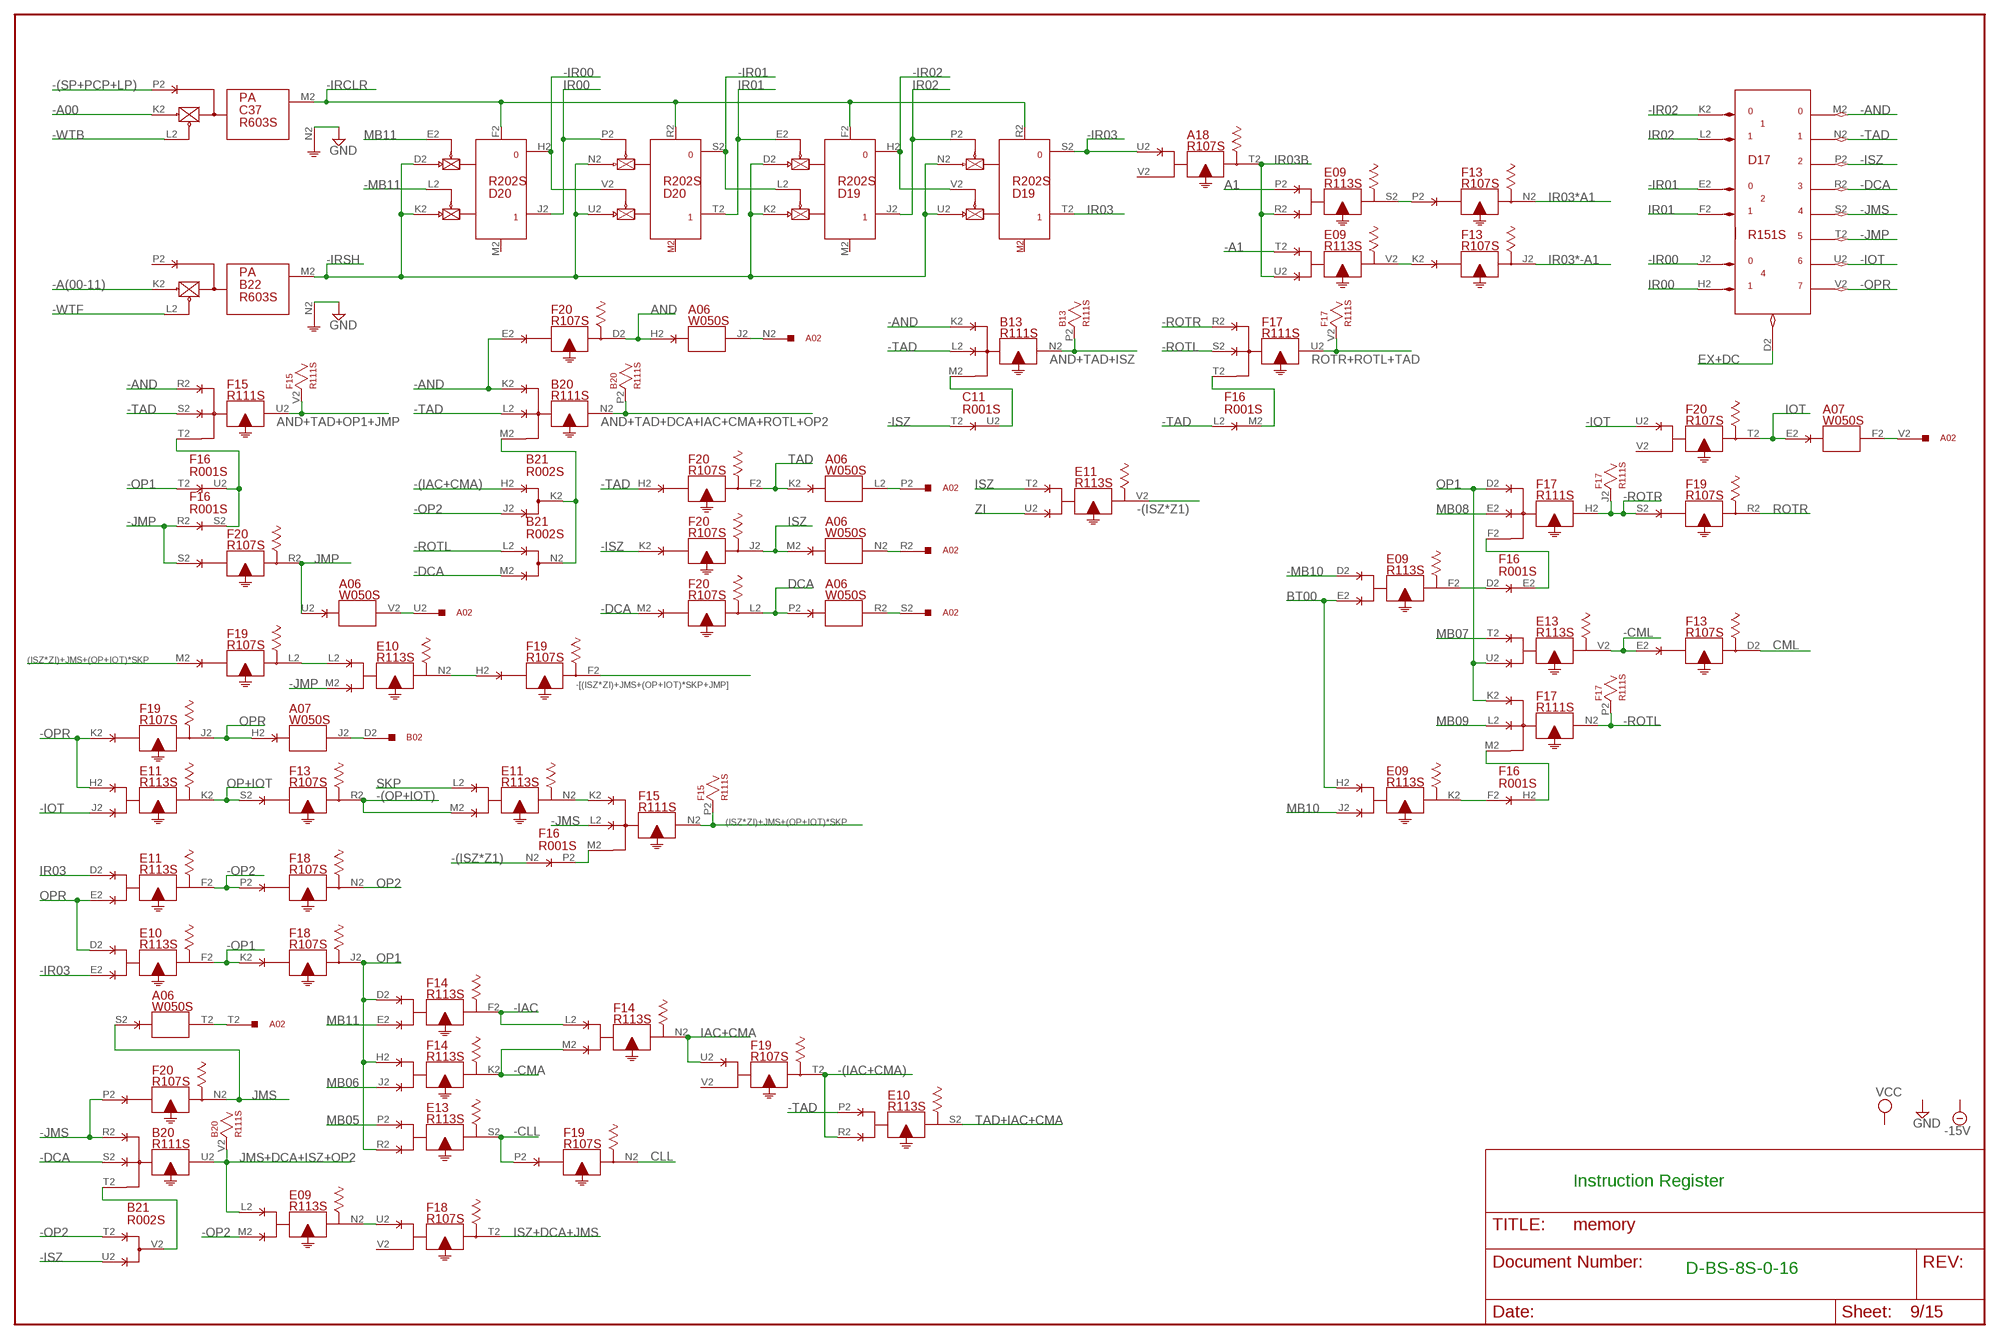
[diagram p8: schematic, sheet 9]

### Parts
A07  W050S  [H807S]
D17  R151S  [H807S]
D19  R202S  [H807S]
D20  R202S  [H807S]
E09  R113S  [H807S]
F14  R113S  [H807S]
F15  R111S  [H807S]
F17  R111S  [H807S]
F19  R107S  [H807S]
F20  R107S  [H807S]

### Nets
(ISZ*ZI)+JMS+(OP+IOT)*SKP: F15.N2(N:O$1) F15.P2 F19.M2(L:I$1) ; also sheet 6
-(IAC+CMA): B21.H2(K:D) E10.R2(S:I$2) F19.T2(T:O$1)
-(ISZ*Z1): E11.V2(V:O$1) F16.N2(P:D)
-(OP+IOT): E11.M2(N:I$2) F13.R2(R:O$1) ; also sheet 1,6
-(SP+PCP+LP): C37.P2(M:I$1) ; also sheet 6,8
-[(ISZ*ZI)+JMS+(OP+IOT)*SKP+JMP]: F19.F2(F:O$1) ; also sheet 6
-A00: C37.K2(M:PU0) ; also sheet 3,4,5,10,14,15
-A1: E09.T2(V:I$1) ; also sheet 6
-A(00-11): B22.K2(M:PU0) ; also sheet 1,3,4,5,7,11,12
-AND: B13.K2(N:I$1) B20.K2(N:I$1) D17.M2(M) F15.R2(U:I$1) F20.E2(D:I$1)
-CLL: E13.S2(S:O$1) F19.P2(N:I$1) ; also sheet 3
-CMA: F14.K2(K:O$1) F14.M2(N:I$2)
-CML: E13.V2(V:O$1) F13.E2(D:I$1) ; also sheet 3
-DCA: B20.S2(U:I$2) B21.M2(N:E) D17.R2(R) F20.M2(L:I$1)
-IAC: F14.F2(F:O$1) F14.L2(N:I$1)
-IOT: D17.U2(U) E11.J2(K:I$2) F20.U2(T:I$1)
-IR00: D17.J2(J) D20.H2 D20.V2(T:EN1)
-IR01: D17.E2(E) D19.L2(J:EN1) D20.S2
-IR02: D17.K2(K) D19.H2 D19.V2(T:EN1)
-IR03: A18.U2(T:I$1) D19.S2 E10.E2(F:I$2) ; also sheet 6
-IRCLR: C37.M2(M:O) D19.F2(J:RESET) D19.R2(T:RESET) D20.F2(J:RESET) D20.R2(T:RESET) ; also sheet 10
-IRSH: B22.M2(M:O) D19.D2(J:PU0) D19.K2(J:PU1) D19.N2(T:PU0) D19.U2(T:PU1) D20.D2(J:PU0) D20.K2(J:PU1) D20.N2(T:PU0) D20.U2(T:PU1)
-ISZ: B21.U2(V:E) C11.T2(U:D) D17.P2(P) F20.K2(J:I$1)
-JMP: D17.T2(T) E10.M2(N:I$2) F16.R2(S:D) F20.S2(R:I$1) ; also sheet 15
-JMS: B20.R2(U:I$1) D17.S2(S) F15.L2(N:I$2) F20.P2(N:I$1) ; also sheet 15
-MB10: E09.D2(F:I$1) ; also sheet 1,2,10
-MB11: D20.L2(J:EN1) ; also sheet 1,2,10
-OP1: E10.F2(F:O$1) F16.T2(U:D) F18.K2(J:I$1)
-OP2: B21.J2(K:E) B21.T2(V:D) E09.M2(N:I$2) E11.F2(F:O$1) F18.P2(N:I$1)
-OPR: D17.V2(V) E11.H2(K:I$1) F19.K2(J:I$1) ; also sheet 1
-ROTL: B21.L2(N:D) F17.N2(N:O$1) F17.P2 F17.S2(U:I$2)
-ROTR: F17.H2(H:O$1) F17.J2 F17.R2(U:I$1) F19.S2(R:I$1) ; also sheet 3
-TAD: B13.L2(N:I$2) B20.L2(N:I$2) D17.N2(N) E10.P2(S:I$1) F15.S2(U:I$2) F16.L2(M:D) F20.H2(F:I$1) ; also sheet 12
-WTB: C37.L2(M:EN0) ; also sheet 6,15
-WTF: B22.L2(M:EN0) ; also sheet 6,7,15
A1: E09.P2(S:I$1) ; also sheet 6
AND: A06.H2(J:I$1) F20.D2(D:O$1) ; also sheet 12
AND+TAD+DCA+IAC+CMA+ROTL+OP2: B20.N2(N:O$1) B20.P2 ; also sheet 12
AND+TAD+ISZ: B13.N2(N:O$1) B13.P2 ; also sheet 1,6
AND+TAD+OP1+JMP: F15.U2(U:O$1) F15.V2 ; also sheet 6
BT00: E09.E2(F:I$2) E09.H2(K:I$1) ; also sheet 4,7,15
CLL: F19.N2(N:O$1) ; also sheet 3
CML: F13.D2(D:O$1) ; also sheet 3
DCA: A06.P2(R:I$1) F20.L2(L:O$1) ; also sheet 6
EX+DC: D17.D2(D) ; also sheet 5,7,8,12
GND [Supply]: B22.N2(M:G) C37.N2(M:G) ; also sheet 1,2,3,4,5,6,7,8,10,11,12,14,15
IAC+CMA: F14.N2(N:O$1) F19.U2(T:I$1) ; also sheet 7,12
IOT: A07.E2(F:I$1) F20.T2(T:O$1) ; also sheet 10,15
IR00: D17.H2(H) D20.J2 D20.P2(T:EN0)
IR01: D17.F2(F) D19.E2(J:EN0) D20.T2
IR02: D17.L2(L) D19.J2 D19.P2(T:EN0)
IR03: D19.T2 E11.D2(F:I$1) ; also sheet 6
IR03*-A1: F13.J2(J:O$1) ; also sheet 6
IR03*A1: F13.N2(N:O$1) ; also sheet 6
IR03B: A18.T2(T:O$1) E09.R2(S:I$2) E09.U2(V:I$2)
ISZ: A06.M2(N:I$1) E11.T2(V:I$1) F20.J2(J:O$1)
ISZ+DCA+JMS: F18.T2(T:O$1) ; also sheet 6
JMP: A06.U2(V:I$1) F20.R2(R:O$1) ; also sheet 6
JMS: A06.S2(T:I$1) F20.N2(N:O$1) ; also sheet 6
JMS+DCA+ISZ+OP2: B20.U2(U:O$1) B20.V2 E09.L2(N:I$1)
MB05: E13.P2(S:I$1) ; also sheet 1,3,10
MB06: F14.J2(K:I$2) ; also sheet 1,3,7
MB07: E13.T2(V:I$1) ; also sheet 1,3
MB08: F17.E2(H:I$2) ; also sheet 1,3,6
MB09: F17.L2(N:I$2) ; also sheet 1,3
MB10: E09.J2(K:I$2) ; also sheet 1,8
MB11: D20.E2(J:EN0) F14.E2(F:I$2) ; also sheet 1,5,6,7,12
N$204: A02.V2 A07.F2(F:O$1)
N$205: A02.N2 A06.J2(J:O$1)
N$206: F15.T2(U:I$3) F16.S2(S:E) F16.U2(U:E)
N$207: B20.M2(N:I$3) B21.K2(K:F) B21.N2(N:F)
N$208: B13.M2(N:I$3) C11.U2(U:E)
N$209: A02.P2 A06.L2(L:O$1)
N$210: E09.S2(S:O$1) F13.P2(N:I$1)
N$211: F16.M2(M:E) F17.T2(U:I$3)
N$212: E09.V2(V:O$1) F13.K2(J:I$1)
N$213: A02.R2 A06.N2(N:O$1)
N$214: F16.E2(E:E) F17.F2(H:I$3)
N$215: F16.H2(H:E) F17.M2(N:I$3)
N$216: A02.U2 A06.V2(V:O$1)
N$217: E09.F2(F:O$1) F16.D2(E:D)
N$218: E09.K2(K:O$1) F16.F2(H:D)
N$219: E10.L2(N:I$1) F19.L2(L:O$1)
N$220: A07.J2(J:O$1) B02.D2
N$221: E11.N2(N:O$1) F15.K2(N:I$1)
N$222: E10.N2(N:O$1) F19.H2(F:I$1)
N$223: B20.T2(U:I$3) B21.V2(V:F)
N$224: A02.T2 A06.T2(T:O$1)
N$225: F15.M2(N:I$3) F16.P2(P:E)
N$226: A02.S2 A06.R2(R:O$1)
N$227: E09.N2(N:O$1) F18.U2(T:I$1)
OP1: E13.R2(S:I$2) E13.U2(V:I$2) F14.D2(F:I$1) F14.H2(K:I$1) F17.D2(H:I$1) F17.K2(N:I$1) F18.J2(J:O$1) ; also sheet 6,7,12
OP2: F18.N2(N:O$1) ; also sheet 3,6,7,8,12
OP+IOT: E11.K2(K:O$1) F13.S2(R:I$1)
OPR: A07.H2(J:I$1) E10.D2(F:I$1) E11.E2(F:I$2) F19.J2(J:O$1)
ROTR: F19.R2(R:O$1) ; also sheet 6
ROTR+ROTL+TAD: F17.U2(U:O$1) F17.V2 ; also sheet 3,12
SKP: E11.L2(N:I$1) ; also sheet 3
TAD: A06.K2(L:I$1) F20.F2(F:O$1) ; also sheet 6
TAD+IAC+CMA: E10.S2(S:O$1) ; also sheet 3,12
ZI: E11.U2(V:I$2) ; also sheet 3,7
Unconnected: A18.V2(T:I$2) B22.P2(M:I$1) D19.M2(J:SET) D20.M2(J:SET) F15.J2 F18.V2(T:I$2) F19.V2(T:I$2) F20.V2(T:I$2)

### Notes on the sheet
- Instruction Register
- D-BS-8S-0-16

## Sheet 10 of 15
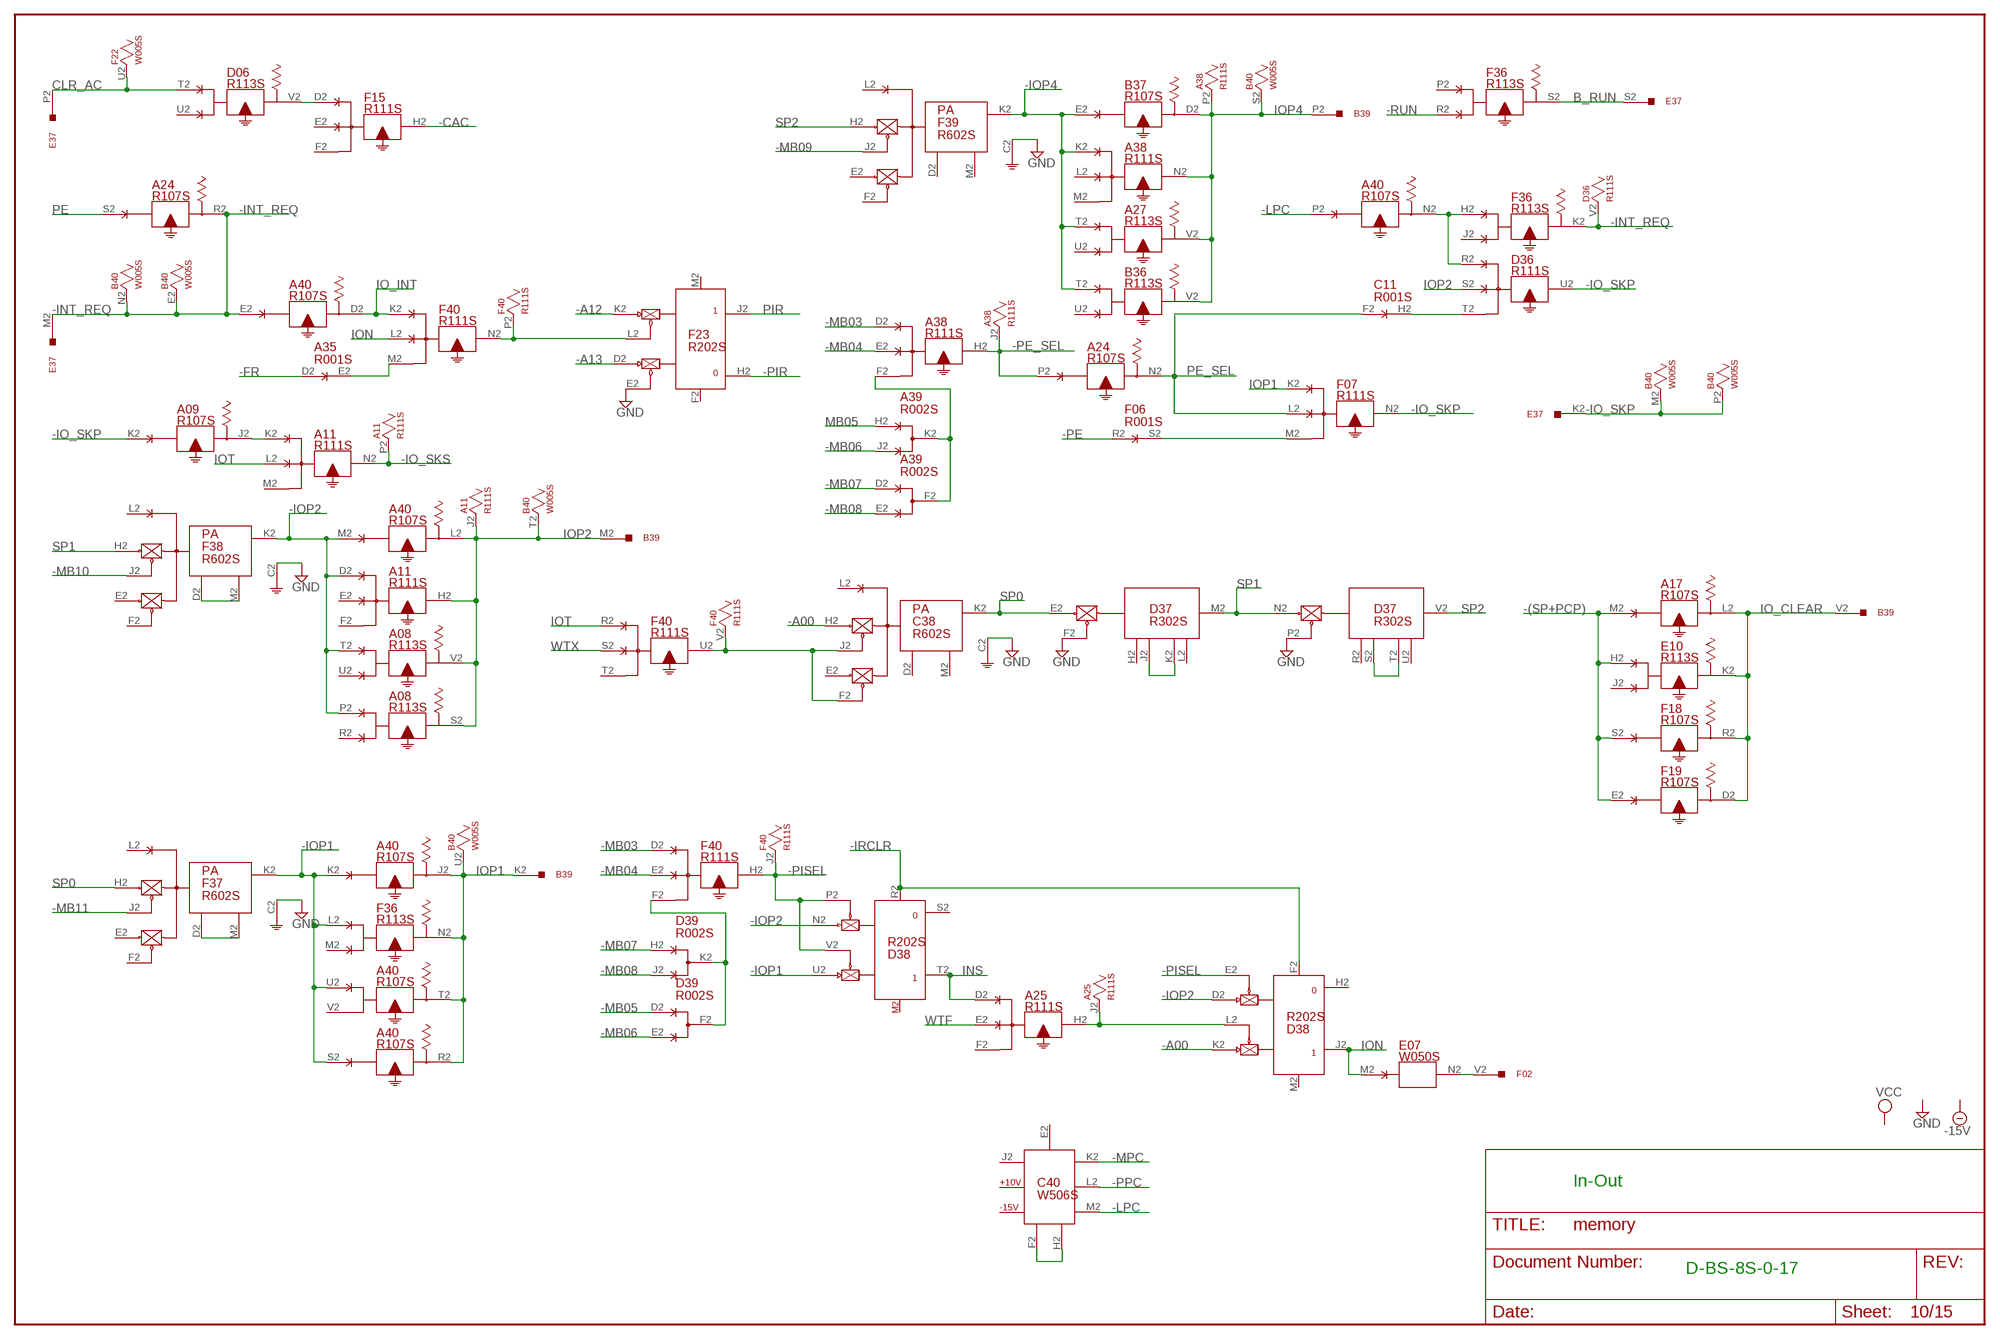
[diagram p9: schematic, sheet 10]

### Parts
A11  R111S  [H807S]
B39  W028S  [H807S]
C40  W506S  [H807S]
D36  R111S  [H807S]
D37  R302S  [H807S]
D38  R202S  [H807S]
D39  R002S  [H807S]
F23  R202S  [H807S]
F40  R111S  [H807S]

### Nets
-(SP+PCP): A17.M2(L:I$1) E10.H2(K:I$1) F18.S2(R:I$1) F19.E2(D:I$1) ; also sheet 1,3,7,8,12,14,15
-A00: C38.H2(K:H) D38.K2(J:PU1) ; also sheet 3,4,5,9,14,15
-A12: F23.K2(J:PU1) ; also sheet 1,3,4,6,8,12,15
-A13: F23.D2(J:PU0) ; also sheet 1,4,5,6,7,15
-CAC: F15.H2(H:O$1) ; also sheet 12
-FR: A35.D2(E:D) ; also sheet 14
-INT_REQ: A24.R2(R:O$1) A40.E2(D:I$1) B40.E2 B40.N2 D36.V2 E37.M2 F36.K2(K:O$1)
-IO_SKP: A09.K2(J:I$1) B40.M2 B40.P2 D36.U2(U:O$1) E37.K2 F07.N2(N:O$1)
-IO_SKS: A11.N2(N:O$1) A11.P2 ; also sheet 3
-IOP1: A40.K2(J:I$1) A40.S2(R:I$1) A40.U2(T:I$1) D38.U2(T:PU1) F36.L2(N:I$1) F37.K2(K:K)
-IOP2: A08.P2(S:I$1) A08.T2(V:I$1) A11.D2(H:I$1) A40.M2(L:I$1) D38.D2(J:PU0) D38.N2(T:PU0) F38.K2(K:K) ; also sheet 14
-IOP4: A27.T2(V:I$1) A38.K2(N:I$1) B36.T2(V:I$1) B37.E2(D:I$1) F39.K2(K:K) ; also sheet 1
-IRCLR: D38.F2(J:RESET) D38.R2(T:RESET) ; also sheet 9
-LPC: A40.P2(N:I$1) C40.M2(M) ; also sheet 8
-MB03: A38.D2(H:I$1) F40.D2(H:I$1) ; also sheet 1,2
-MB04: A38.E2(H:I$2) F40.E2(H:I$2) ; also sheet 1,2,5
-MB05: D39.D2(F:D) ; also sheet 1,2,6
-MB06: A39.J2(K:E) D39.E2(F:E) ; also sheet 1,2,6,7
-MB07: A39.D2(F:D) D39.H2(K:D) ; also sheet 1,2,6
-MB08: A39.E2(F:E) D39.J2(K:E) ; also sheet 1,2,3
-MB09: F39.J2(K:J) ; also sheet 1,2
-MB10: F38.J2(K:J) ; also sheet 1,2,9
-MB11: F37.J2(K:J) ; also sheet 1,2,9
-MPC: C40.K2(K) ; also sheet 13,14
-PE: F06.R2(S:D) ; also sheet 1
-PE_SEL: A24.P2(N:I$1) A38.H2(H:O$1) A38.J2 ; also sheet 1
-PIR: F23.H2 ; also sheet 6
-PISEL: D38.E2(J:EN0) D38.P2(T:EN0) D38.V2(T:EN1) F40.H2(H:O$1) F40.J2
-PPC: C40.L2(L) ; also sheet 4,6,8,11,15
-RUN: F36.R2(S:I$2) ; also sheet 4,8
B_RUN: E37.S2 F36.S2(S:O$1)
CLR_AC: D06.T2(V:I$1) E37.P2 F22.U2
GND [Supply]: C38.C2(K:GND) D37.F2(M:F) D37.P2(V:F) F23.E2(J:EN0) F37.C2(K:GND) F38.C2(K:GND) F39.C2(K:GND) ; also sheet 1,2,3,4,5,6,7,8,9,11,12,14,15
INS: A25.D2(H:I$1) D38.T2
IO_CLEAR: A17.L2(L:O$1) B39.V2 E10.K2(K:O$1) F18.R2(R:O$1) F19.D2(D:O$1)
IO_INT: A40.D2(D:O$1) F40.K2(N:I$1)
ION: D38.J2 E07.M2(N:I$1) F40.L2(N:I$2)
IOP1: A40.J2(J:O$1) A40.R2(R:O$1) A40.T2(T:O$1) B39.K2 B40.U2 F07.K2(N:I$1) F36.N2(N:O$1)
IOP2: A08.S2(S:O$1) A08.V2(V:O$1) A11.H2(H:O$1) A11.J2 A40.L2(L:O$1) B39.M2 B40.T2 D36.S2(U:I$2)
IOP4: A27.V2(V:O$1) A38.N2(N:O$1) A38.P2 B36.V2(V:O$1) B37.D2(D:O$1) B39.P2 B40.S2
IOT: A11.L2(N:I$2) F40.R2(U:I$1) ; also sheet 9,15
MB05: A39.H2(K:D) ; also sheet 1,3,9
N$228: F23.L2(J:EN1) F40.N2(N:O$1) F40.P2
N$229: D06.V2(V:O$1) F15.D2(H:I$1)
N$230: A35.E2(E:E) F40.M2(N:I$3)
N$231: F38.D2(K:D) F38.M2(K:M)
N$232: A09.J2(J:O$1) A11.K2(N:I$1)
N$233: A25.H2(H:O$1) A25.J2 D38.L2(J:EN1)
N$234: E07.N2(N:O$1) F02.V2
N$235: F37.D2(K:D) F37.M2(K:M)
N$236: D39.F2(F:F) D39.K2(K:F) F40.F2(H:I$3)
N$237: C40.F2(F) C40.H2(H)
N$238: C38.F2(K:F) C38.J2(K:J) F40.U2(U:O$1) F40.V2
N$239: D37.J2(M:J) D37.K2(M:K)
N$240: D37.S2(V:J) D37.T2(V:K)
N$241: F06.S2(S:E) F07.M2(N:I$3)
N$242: C11.H2(H:E) D36.T2(U:I$3)
N$243: A38.F2(H:I$3) A39.F2(F:F) A39.K2(K:F)
N$244: A40.N2(N:O$1) D36.R2(U:I$1) F36.H2(K:I$1)
PE: A24.S2(R:I$1) ; also sheet 1
PE_SEL: A24.N2(N:O$1) C11.F2(H:D) F07.L2(N:I$2)
PIR: F23.J2 ; also sheet 6
SP0: C38.K2(K:K) D37.E2(M:E) F37.H2(K:H)
SP1: D37.M2(M:M) D37.N2(V:E) F38.H2(K:H)
SP2: D37.V2(V:M) F39.H2(K:H)
WTF: A25.E2(H:I$2) ; also sheet 1,3,5,6,8,12
WTX: F40.S2(U:I$2) ; also sheet 1,3,6,7,12,15
Unconnected: A08.R2(S:I$2) A08.U2(V:I$2) A11.E2(H:I$2) A11.F2(H:I$3) A11.M2(N:I$3) A11.V2 A25.F2(H:I$3) A27.U2(V:I$2) A38.L2(N:I$2) A38.M2(N:I$3) A40.V2(T:I$2) B36.U2(V:I$2) B39.S2 B39.T2 C38.D2(K:D) C38.E2(K:E) C38.L2(K:L) C38.M2(K:M) C40.E2(E) C40.J2(J) D06.U2(V:I$2) D37.H2(M:H) D37.L2(M:L) D37.R2(V:H) D37.U2(V:L) D38.H2 D38.M2(J:SET) D38.S2 E10.J2(K:I$2) F15.E2(H:I$2) F15.F2(H:I$3) F23.F2(J:RESET) F23.M2(J:SET) F23.N2(T:PU0) F23.P2(T:EN0) F23.R2(T:RESET) F23.S2 F23.T2 F23.U2(T:PU1) F23.V2(T:EN1) F36.J2(K:I$2) F36.M2(N:I$2) F36.P2(S:I$1) F37.E2(K:E) F37.F2(K:F) F37.L2(K:L) F38.E2(K:E) F38.F2(K:F) F38.L2(K:L) F39.D2(K:D) F39.E2(K:E) F39.F2(K:F) F39.L2(K:L) F39.M2(K:M) F40.T2(U:I$3)

### Notes on the sheet
- In-Out
- D-BS-8S-0-17